# EAGLE board Preselector - Copy (EAGLE 7.7.0)
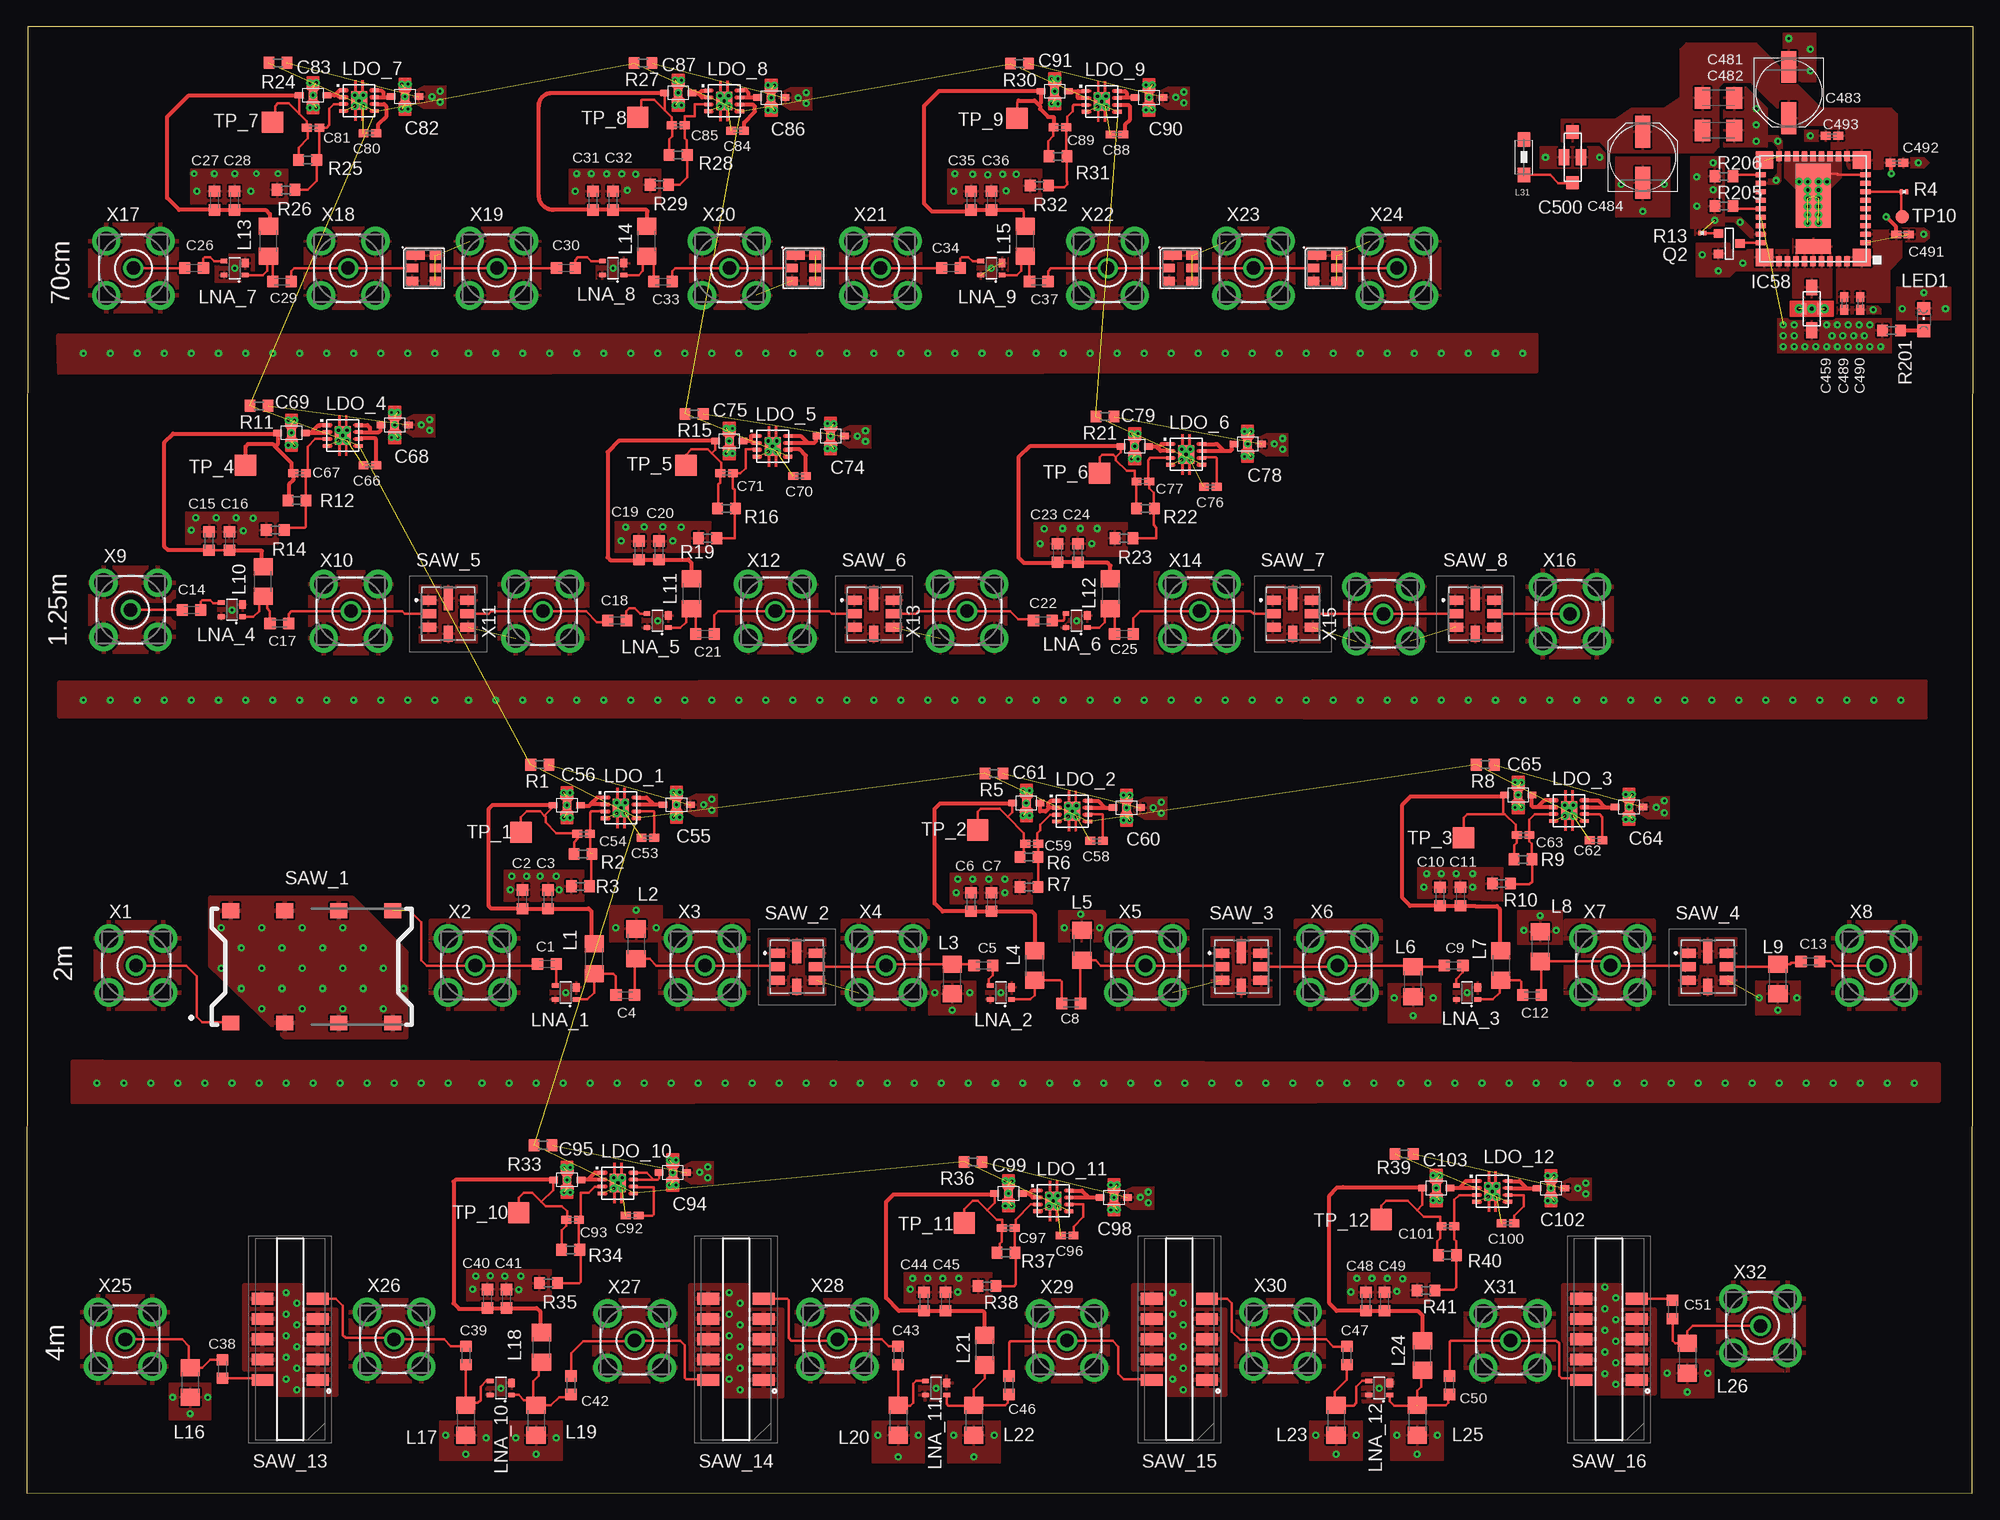
[diagram p5: board, top side]
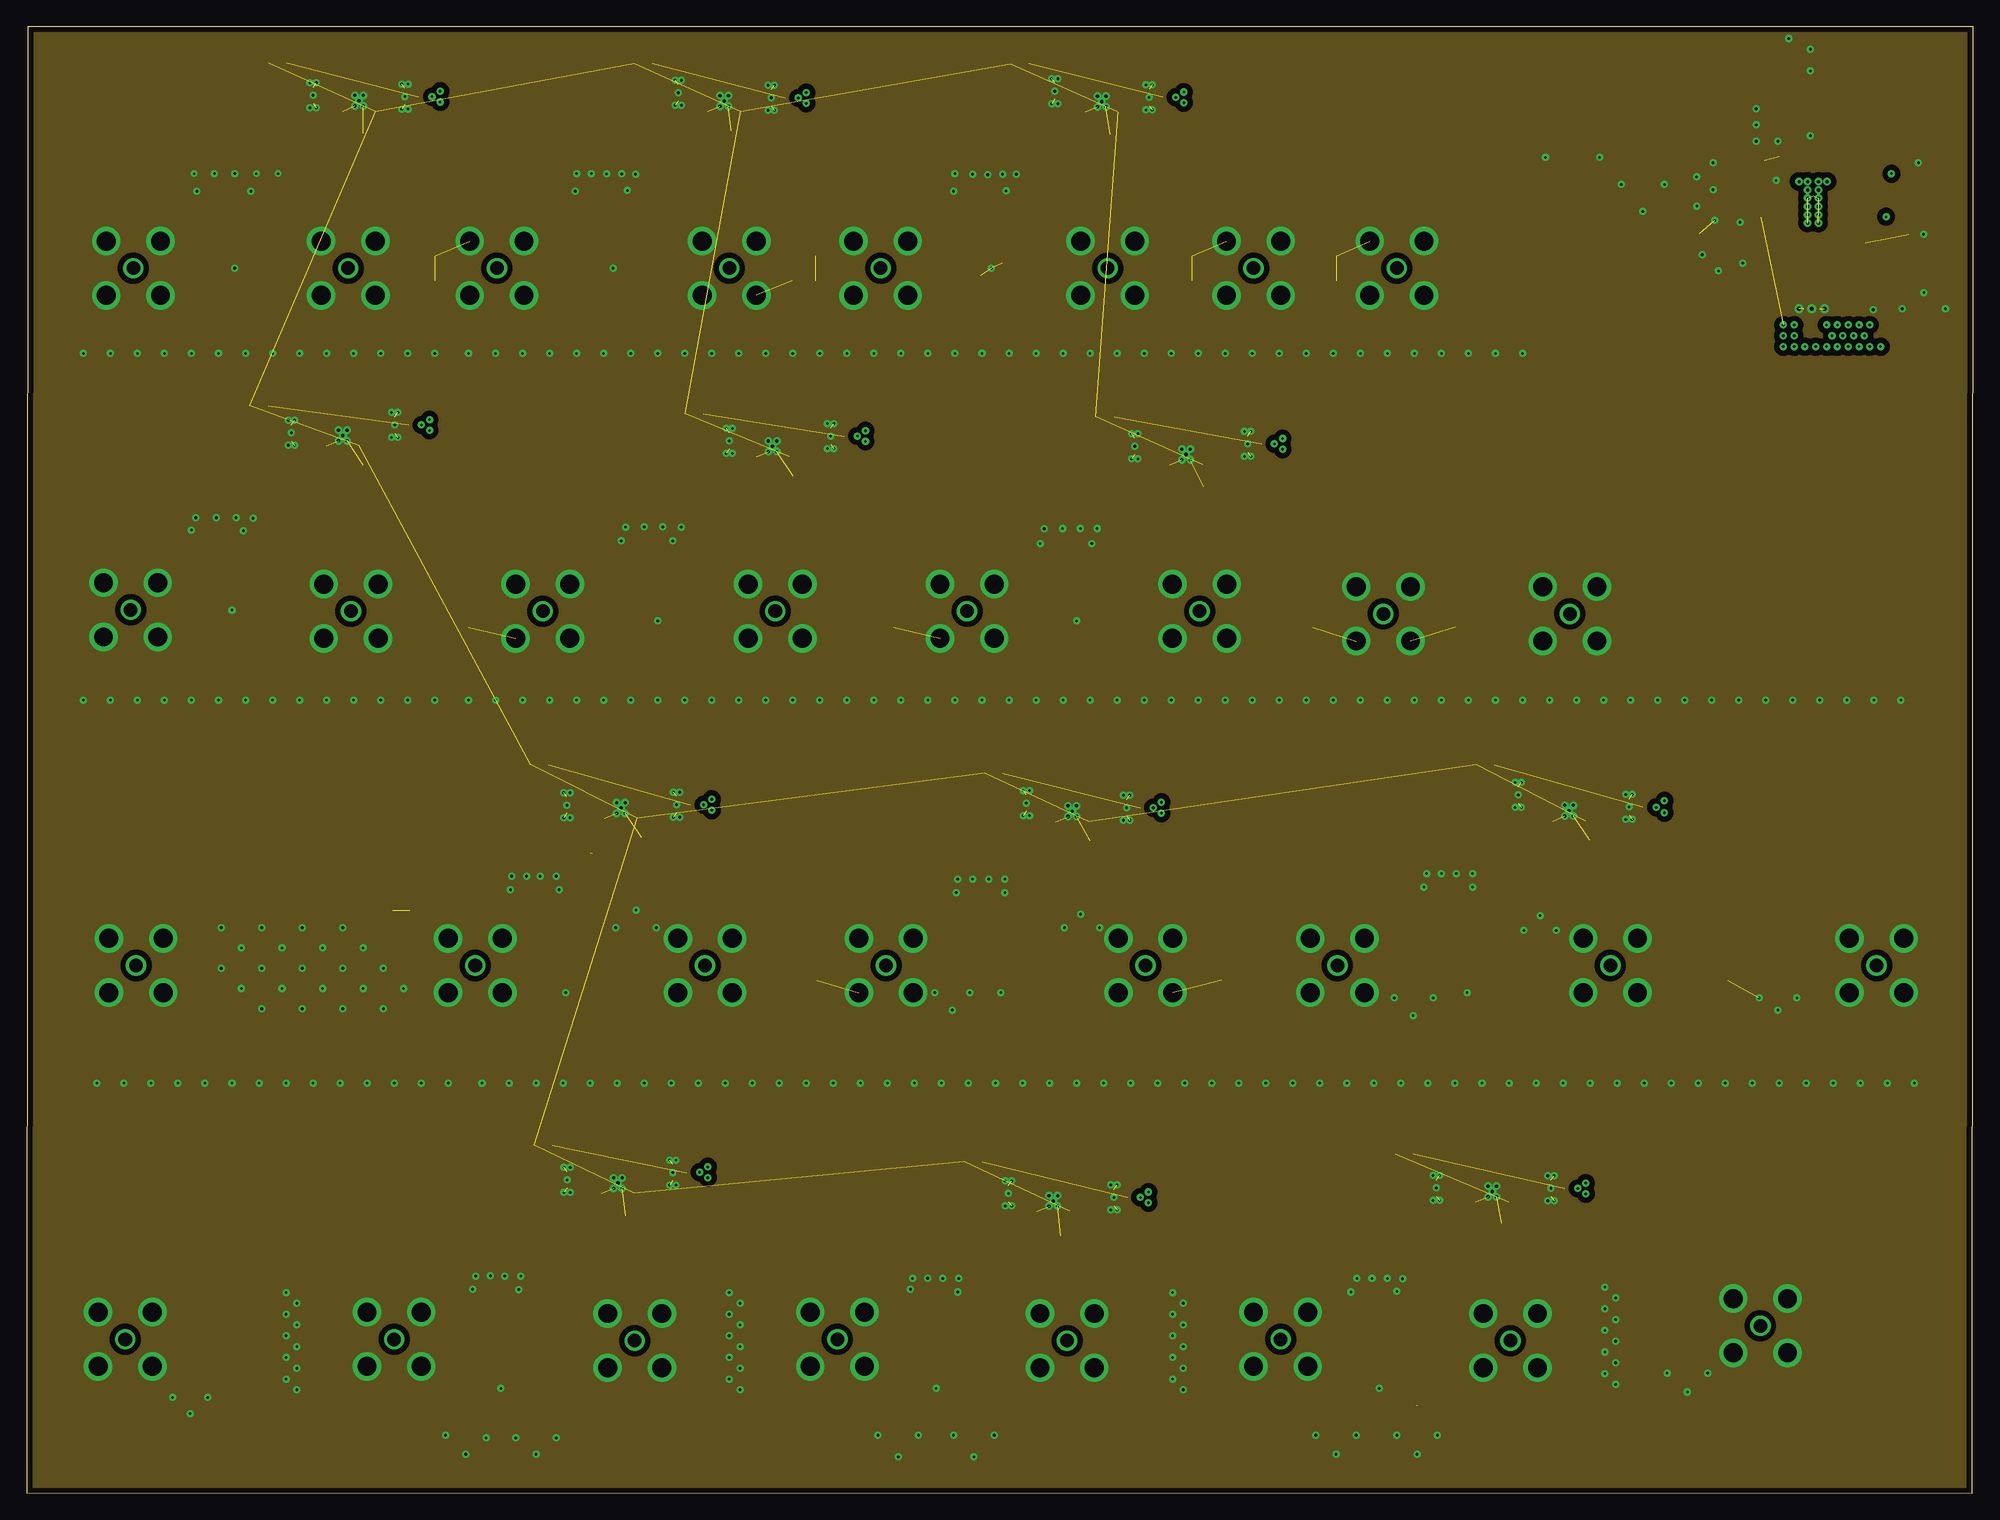
[diagram p6: board, inner layer GND]
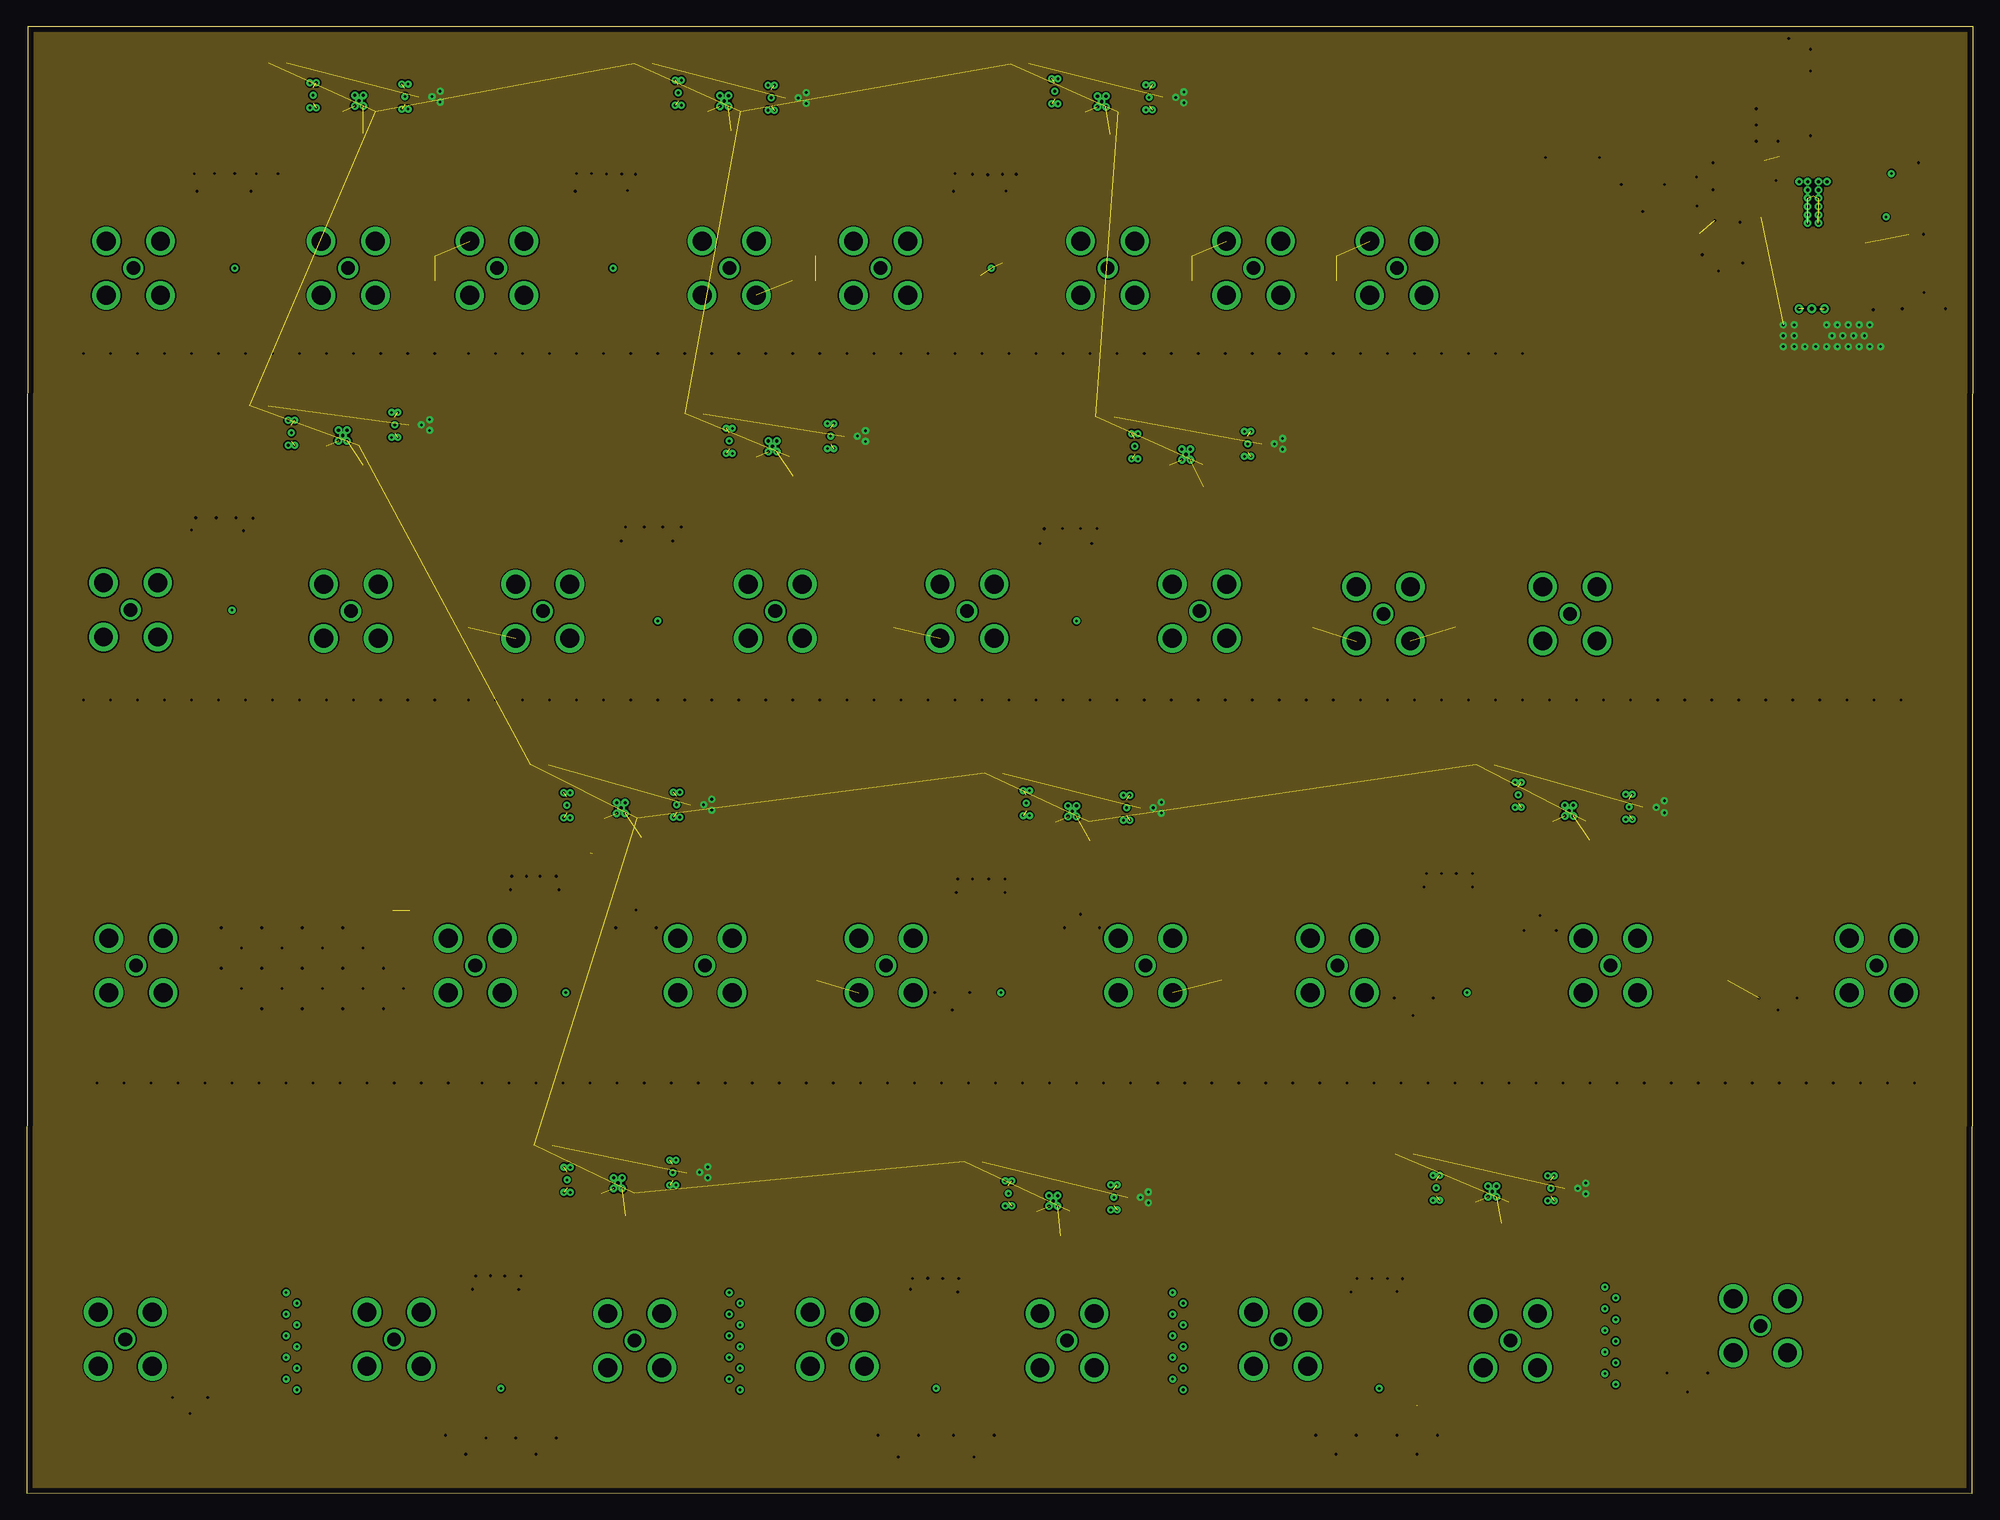
[diagram p7: board, inner layer PWR]
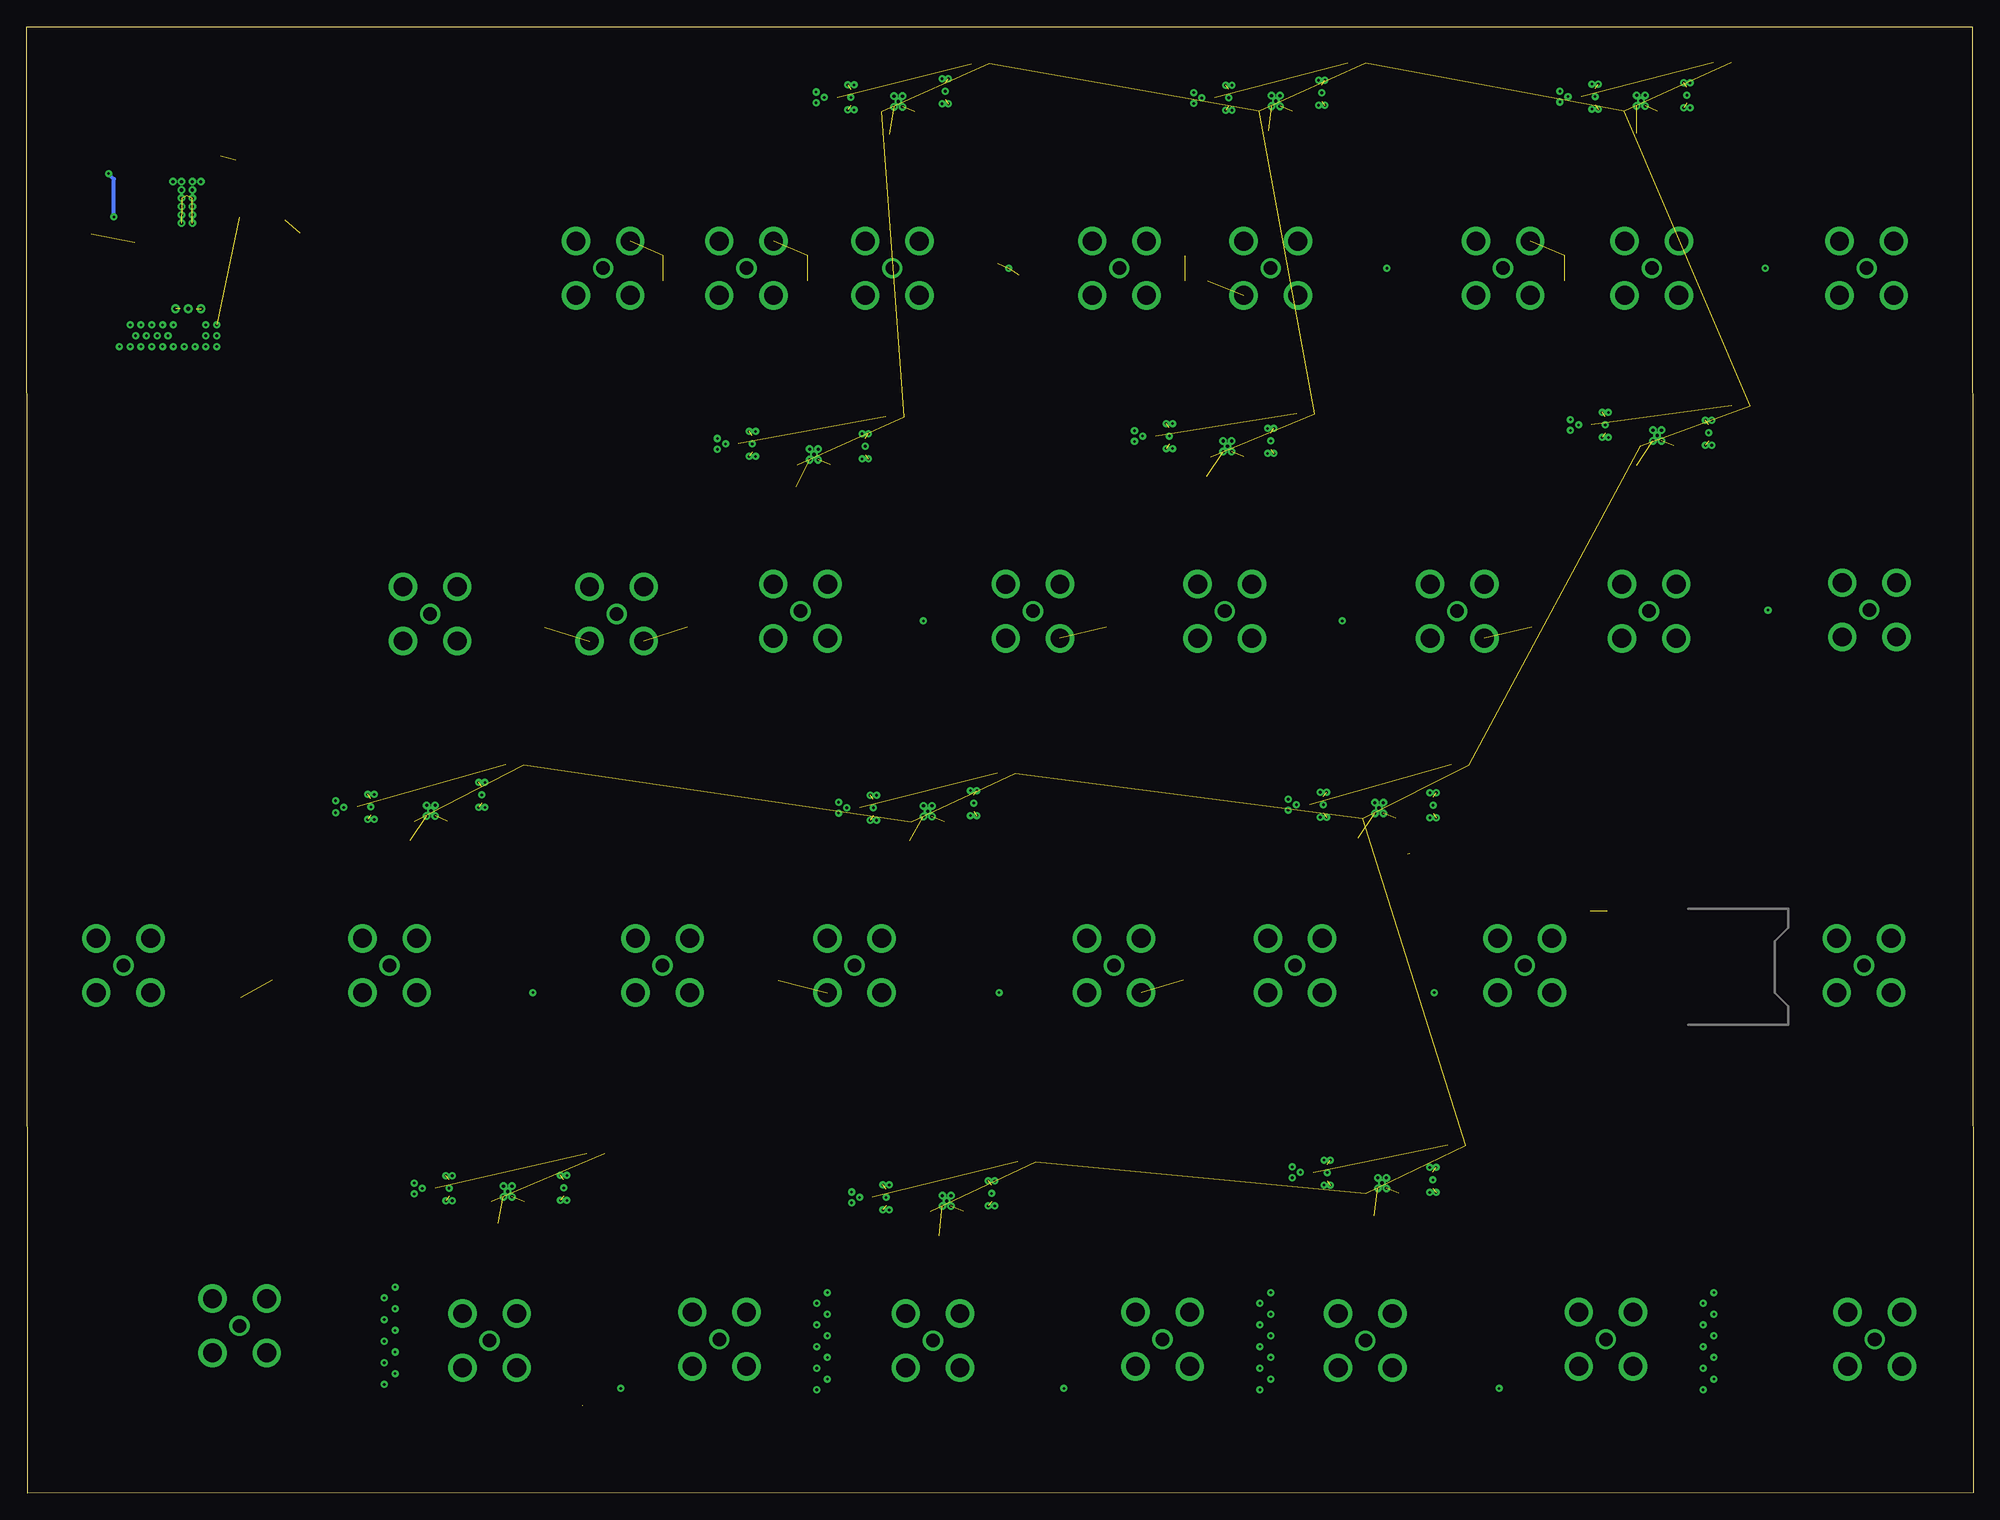
[diagram p8: board, bottom side, seen from below]

Size 182.96 x 137.82 mm. Coordinates in mm from the lower left corner, seen from the top.
Outline: 0,0.05 182.86,0 182.96,137.82 0.1,137.82 0,0.05
Copper layers ((1*2)+(15*16)): Top 0.035mm / dielectric 0.15mm / GND 0.035mm / dielectric 0.15mm / PWR 0.035mm / dielectric 0.2mm / Bottom 0.035mm
Design rules "default *": minimum track width 8mil, minimum drill 8mil, track to track 5mil, track to pad 5mil, pad to pad 5mil, via to via 5mil, smd to smd 5mil, copper to edge 20mil, drill to drill 8mil, minimum pad ring 8mil, minimum via ring 8mil, stop-mask expansion 4mil, vias tented up to drill 0mil, thermal gap 8mil
Net classes: 0 default: width 0.102 mm, drill 0.203 mm, clearance 0.102 mm; 1 GND: width 0.203 mm, drill 0.229 mm, clearance 0.203 mm to class 0, clearance 0.203 mm

## Footprints (pad centres in the part's own frame; a part is rotated, then mirrored left to right if it is on the bottom)
C0603K = smd 1.05 x 1.08: 1 -0.875,0; 2 0.875,0
C0402K = smd 0.925 x 0.74: 1 -0.6,0; 2 0.6,0
NFM21PS = smd 0.8 x 0.85: GND1 0,0 | smd 1.2 x 0.3: GND2 0,-0.775; GND3 0,0.775 | drill 0.25: GND4 0,0; GND5 -0.3,-1.175; GND6 0.3,-1.175; GND7 0.3,1.175; GND8 -0.3,1.175 | smd 0.8 x 0.6: IN -1.3,0; OUT 1.3,0
NFM31PC276 = smd 1 x 0.5: GND1 0,0.75; GND2 0,-0.75 | drill 0.4: GND3 0,0; GND4 0,1.2; GND5 0,-1.2 | smd 1.5 x 1: IN -2,0; OUT 2,0
C1206K = smd 1.5 x 2: 1 -1.5,0; 2 1.5,0
PANASONIC_D = smd 3 x 1.4: + 2.4,0; - -2.4,0
NFM1806 = smd 1.25 x 1.2: 1 -2.375,0; 2 2.375,0 | smd 1.5 x 1: GND@1 0,-0.8; GND@2 0,0.8
RVQ = smd 1.65 x 1.65: 1 -4.575,-4.575; 11 4.575,-4.575; 21 4.575,4.575; 31 -4.575,4.575 | smd 0.5 x 0.95: 2 -3.2,-4.925; 3 -2.4,-4.925; 4 -1.6,-4.925; 5 -0.8,-4.925; 6 0,-4.925; 7 0.8,-4.925; 8 1.6,-4.925; 9 2.4,-4.925; 10 3.2,-4.925; 22 3.2,4.925; 23 2.4,4.925; 24 1.6,4.925; 25 0.8,4.925; 26 0,4.925; 27 -0.8,4.925; 28 -1.6,4.925; 29 -2.4,4.925; 30 -3.2,4.925 | smd 0.95 x 0.5: 12 4.925,-3.2; 13 4.925,-2.4; 14 4.925,-1.6; 15 4.925,-0.8; 16 4.925,0; 17 4.925,0.8; 18 4.925,1.6; 19 4.925,2.4; 20 4.925,3.2; 32 -4.925,3.2; 33 -4.925,2.4; 34 -4.925,1.6; 35 -4.925,0.8; 36 -4.925,0; 37 -4.925,-0.8; 38 -4.925,-1.6; 39 -4.925,-2.4; 40 -4.925,-3.2 | smd 1.4 x 3.29: 41 -3.55,0 | smd 6.05 x 3.29: 42 1.225,0 | drill 0.3 pad 0.61: 42A -1.35,-0.51; 42B -1.35,0.51; 42C -0.57,-0.51; 42D -0.57,0.51; 42E 0.21,-0.51; 42F 0.21,0.51; 42G 0.99,-0.51; 42H 0.99,0.51; 42J 1.77,-0.51; 42K 1.77,0.51; 42L 2.55,-0.51; 42M 2.55,0.51; 42N 2.55,-1.31; 42P 2.55,1.31
C1206 = smd 1.6 x 1.8: 1 -1.4,0; 2 1.4,0
1206 = smd 1.35 x 1.2: 1 -1.7,0; 2 1.65,0
DRB = smd 0.35 x 0.65: 1 -0.975,-1.55; 2 -0.325,-1.55; 3 0.325,-1.55; 4 0.975,-1.55; 5 0.975,1.55; 6 0.325,1.55; 7 -0.325,1.55; 8 -0.975,1.55 | drill 0.3 pad 0.406: P1 -0.5,0.4; P2 0.5,0.4; P3 0,0; P4 -0.5,-0.4; P5 0.5,-0.4 | smd 1.75 x 1.5: PAD 0,0
CHIPLED_0805 = smd 1.2 x 1.2: A 0,-1.05; C 0,1.05
SPF-5043Z = smd 0.425 x 0.64: 1 -0.65,-0.995; 3 0.67,1; 4 -0.65,1 | smd 0.8 x 0.64: 2 0.48,-0.995
SOT-23 = smd 0.787 x 0.889: 1 0.025,-1.016; 2 -0.94,1.016; 3 0.991,1.016
R0603 = smd 1 x 1.1: 1 -0.85,0; 2 0.85,0
R0201 = smd 0.28 x 0.43: 1 -0.255,0; 2 0.255,0
SXBP-140+ = smd 1.626 x 1.397: 1 -7.62,-5.397; 2 -7.62,5.144; 3 -2.54,-5.397; 4 -2.54,5.144; 5 2.54,-5.397; 6 2.54,5.144; 7 7.62,-5.397; 8 7.62,5.144
TA147FD = smd 1.47 x 0.84: 1 -1.865,1.27; 2 -1.865,0; 3 -1.865,-1.27; 5 1.865,-1.27; 6 1.865,0; 7 1.865,1.27 | smd 0.84 x 1.47: 4 0,-1.865 | smd 0.84 x 2.28: 8 0,1.46
TA0576A = smd 1.47 x 0.84: 1 -1.865,1.27; 2 -1.865,0; 3 -1.865,-1.27; 5 1.865,-1.27; 6 1.865,0; 7 1.865,1.27 | smd 0.84 x 1.47: 4 0,-1.865 | smd 0.84 x 2.28: 8 0,1.46
TA1914A = smd 1.7 x 0.81: 1 -0.75,1.195 | smd 1.05 x 0.81: 2 -1.075,0.005; 3 -1.075,-1.185; 4 1.075,-1.185; 5 1.075,0.005; 6 1.075,1.195
S511214 = smd 2.05 x 1.1: 1 -2.6,3.82; 2 -2.6,1.91; 3 -2.6,0; 4 -2.6,-1.91; 5 -2.6,-3.82; 6 2.6,-3.82; 7 2.6,-1.91; 8 2.6,0; 9 2.6,1.91; 10 2.6,3.82
B1,27 = smd 1.27 x 1.27: TP 0,0
TP20SQ = smd 2 x 2: TP 0,0
BU-SMA-V = drill 1.27: 1 0,0 | drill 1.778: 2 -2.55,2.55; 3 2.55,2.55; 4 2.55,-2.55; 5 -2.55,-2.55

## Placement (x,y rotation side)
C1  100p  [C0603K]  48.9,49.71 0 top
C2  0.1u  [C0603K]  46.61,55.8 90 top
C3  100p  [C0603K]  49.02,55.8 90 top
C4  8p  [C0603K]  56.26,46.79 0 top
C5  12p  [C0603K]  89.92,49.58 0 top
C6  0.1u  [C0603K]  88.77,55.55 90 top
C7  100p  [C0603K]  90.68,55.55 90 top
C8  8p  [C0603K]  98.17,46.02 180 top
C9  12p  [C0603K]  134.11,49.58 0 top
C10  0.1u  [C0603K]  132.84,56.06 90 top
C11  100p  [C0603K]  134.75,56.06 90 top
C12  8p  [C0603K]  141.48,46.79 0 top
C13  12p  [C0603K]  167.64,49.96 0 top
C14  100p  [C0603K]  15.49,83.01 0 top
C15  0.1u  [C0603K]  17.14,89.48 90 top
C16  100p  [C0603K]  19.05,89.48 90 top
C17  100p  [C0603K]  23.75,81.74 0 top
C18  100p  [C0603K]  55.5,81.99 0 top
C19  0.1u  [C0603K]  57.53,88.6 90 top
C20  100p  [C0603K]  59.44,88.6 90 top
C21  100p  [C0603K]  63.75,80.72 0 top
C22  100p  [C0603K]  95.5,81.99 0 top
C23  0.1u  [C0603K]  96.9,88.34 90 top
C24  100p  [C0603K]  98.81,88.34 90 top
C25  100p  [C0603K]  103.12,80.72 0 top
C26  100p  [C0603K]  15.75,115.11 0 top
C27  0.1u  [C0603K]  17.65,121.46 90 top
C28  100p  [C0603K]  19.56,121.46 90 top
C29  100p  [C0603K]  24,113.84 0 top
C30  100p  [C0603K]  50.67,115.11 0 top
C31  0.1u  [C0603K]  53.21,121.46 90 top
C32  100p  [C0603K]  55.12,121.46 90 top
C33  100p  [C0603K]  59.82,113.84 0 top
C34  100p  [C0603K]  86.87,115.11 0 top
C35  0.1u  [C0603K]  88.77,121.46 90 top
C36  100p  [C0603K]  90.68,121.46 90 top
C37  100p  [C0603K]  95.12,113.84 0 top
C38  160p  [C0603K]  18.41,11.66 270 top
C39  180p  [C0603K]  41.27,12.93 270 top
C40  0.1u  [C0603K]  43.31,18.26 90 top
C41  100p  [C0603K]  45.09,18.26 90 top
C42  160p  [C0603K]  51.18,10.13 90 top
C43  180p  [C0603K]  81.92,12.93 270 top
C44  0.1u  [C0603K]  84.33,18.01 90 top
C45  100p  [C0603K]  86.36,18.01 90 top
C46  160p  [C0603K]  92.33,10.13 90 top
C47  180p  [C0603K]  124.08,12.93 270 top
C48  0.1u  [C0603K]  125.86,18.01 90 top
C49  100p  [C0603K]  127.64,18.01 90 top
C50  160p  [C0603K]  133.73,10.13 90 top
C51  180p  [C0603K]  154.69,17.25 270 top
C53  470n  [C0402K]  58.39,61.59 180 top
C54  470n  [C0402K]  52.35,61.95 180 top
C55  NFM21PS106B0J3D  [NFM21PS]  61.09,64.69 180 top
C56  NFM21PS106B0J3D  [NFM21PS]  50.77,64.64 180 top
C58  470n  [C0402K]  100.56,61.29 180 top
C59  470n  [C0402K]  94.46,61.04 180 top
C60  NFM21PS106B0J3D  [NFM21PS]  103.38,64.41 180 top
C61  NFM21PS106B0J3D  [NFM21PS]  93.95,64.85 180 top
C62  470n  [C0402K]  147.5,61.34 180 top
C63  470n  [C0402K]  140.64,61.85 180 top
C64  NFM21PS106B0J3D  [NFM21PS]  150.6,64.49 180 top
C65  NFM21PS106B0J3D  [NFM21PS]  140.18,65.61 180 top
C66  470n  [C0402K]  32.26,96.6 180 top
C67  470n  [C0402K]  25.65,95.83 180 top
C68  NFM21PS106B0J3D  [NFM21PS]  34.59,100.38 180 top
C69  NFM21PS106B0J3D  [NFM21PS]  24.89,99.64 180 top
C70  470n  [C0402K]  72.64,95.58 180 top
C71  470n  [C0402K]  65.79,95.83 180 top
C74  NFM21PS106B0J3D  [NFM21PS]  75.56,99.34 180 top
C75  NFM21PS106B0J3D  [NFM21PS]  66.04,98.88 180 top
C76  470n  [C0402K]  111.25,94.56 180 top
C77  470n  [C0402K]  104.9,95.07 180 top
C78  NFM21PS106B0J3D  [NFM21PS]  114.76,98.6 180 top
C79  NFM21PS106B0J3D  [NFM21PS]  104.14,98.37 180 top
C80  470n  [C0402K]  32.26,127.81 180 top
C81  470n  [C0402K]  26.92,128.32 180 top
C82  NFM21PS106B0J3D  [NFM21PS]  35.56,131.24 180 top
C83  NFM21PS106B0J3D  [NFM21PS]  26.92,131.37 180 top
C84  470n  [C0402K]  66.83,128.04 180 top
C85  470n  [C0402K]  61.24,128.55 180 top
C86  NFM21PS106B0J3D  [NFM21PS]  69.98,131.14 180 top
C87  NFM21PS106B0J3D  [NFM21PS]  61.24,131.6 180 top
C88  470n  [C0402K]  102.46,127.69 180 top
C89  470n  [C0402K]  97.1,128.35 180 top
C90  NFM21PS106B0J3D  [NFM21PS]  105.49,131.17 180 top
C91  NFM21PS106B0J3D  [NFM21PS]  96.62,131.75 180 top
C92  470n  [C0402K]  56.92,26.09 180 top
C93  470n  [C0402K]  51.31,25.7 180 top
C94  NFM21PS106B0J3D  [NFM21PS]  60.73,30.12 180 top
C95  NFM21PS106B0J3D  [NFM21PS]  50.8,29.44 180 top
C96  470n  [C0402K]  97.79,24.21 180 top
C97  470n  [C0402K]  92.25,24.92 180 top
C98  NFM21PS106B0J3D  [NFM21PS]  102.18,27.79 180 top
C99  NFM21PS106B0J3D  [NFM21PS]  92.28,28.17 180 top
C100  470n  [C0402K]  139.22,25.35 180 top
C101  470n  [C0402K]  133.58,25.07 180 top
C102  NFM21PS106B0J3D  [NFM21PS]  143.26,28.65 180 top
C103  NFM21PS106B0J3D  [NFM21PS]  132.49,28.68 180 top
C459  [NFM31PC276]  167.77,111.3 270 top
C481  33u  [C1206K]  159,131.11 0 top
C482  33u  [C1206K]  159,128.07 0 top
C483  EEE-FK1V470P  [PANASONIC_D]  165.61,131.62 270 top
C484  EEE-FK1V470P  [PANASONIC_D]  151.89,125.53 90 top
C489  .1u 50V  [C0402K]  170.81,111.81 270 top
C490  .1u 50V  [C0402K]  172.34,111.81 270 top
C491  .1u 50V  [C0402K]  176.3,118.29 0 top
C492  .1u 50V  [C0402K]  175.77,125.02 0 top
C493  .1u 50V  [C0402K]  169.67,127.56 180 top
C500  NFM41PC155B1E3  [NFM1806]  145.29,125.53 90 top
IC58  LMZ31707RVQ  [RVQ]  167.89,120.7 90 top
L1  100n  [C1206]  53.34,50.22 90 top
L2  56n  [C1206]  57.28,51.61 270 top
L3  47n  [C1206]  87,48.31 90 top
L4  100n  [C1206]  94.74,49.58 90 top
L5  56n  [C1206]  99.19,51.49 270 top
L6  47n  [C1206]  130.3,48.06 90 top
L7  100n  [C1206]  138.56,49.58 270 top
L8  56n  [C1206]  142.24,51.36 270 top
L9  47n  [C1206]  164.59,48.31 90 top
L10  100n  [C1206]  22.23,85.67 90 top
L11  100n  [C1206]  62.48,84.53 90 top
L12  100n  [C1206]  101.85,84.53 270 top
L13  100n  [C1206]  22.73,117.65 90 top
L14  100n  [C1206]  58.29,117.65 90 top
L15  100n  [C1206]  93.85,117.65 90 top
L16  100n  [C1206]  15.37,10.39 270 top
L17  100n  [C1206]  41.27,6.83 270 top
L18  100n  [C1206]  48.39,13.69 90 top
L19  100n  [C1206]  47.88,6.83 270 top
L20  100n  [C1206]  81.92,6.83 270 top
L21  100n  [C1206]  90.04,13.44 90 top
L22  100n  [C1206]  89.03,6.83 270 top
L23  100n  [C1206]  123.06,6.83 270 top
L24  100n  [C1206]  131.19,12.93 90 top
L25  100n  [C1206]  130.68,6.83 270 top
L26  100n  [C1206]  156.08,12.67 270 top
L31  BLM31PG121SN1L  [1206]  140.72,125.53 270 top
LDO_1  TPS7A8101DRB  [DRB]  55.85,64.39 270 top
LDO_2  TPS7A8101DRB  [DRB]  98.27,64.08 270 top
LDO_3  TPS7A8101DRB  [DRB]  144.96,64.13 270 top
LDO_4  TPS7A8101DRB  [DRB]  29.72,99.39 270 top
LDO_5  TPS7A8101DRB  [DRB]  70.1,98.37 270 top
LDO_6  TPS7A8101DRB  [DRB]  108.97,97.61 270 top
LDO_7  TPS7A8101DRB  [DRB]  31.24,130.86 270 top
LDO_8  TPS7A8101DRB  [DRB]  65.56,130.84 270 top
LDO_9  TPS7A8101DRB  [DRB]  101.04,130.78 270 top
LDO_10  TPS7A8101DRB  [DRB]  55.58,29.13 270 top
LDO_11  TPS7A8101DRB  [DRB]  96.49,27.46 270 top
LDO_12  TPS7A8101DRB  [DRB]  137.74,28.35 270 top
LED1  LTST-C170GKT  [CHIPLED_0805]  178.31,110.29 0 top
LNA_1  SPF-5043Z  [SPF-5043Z]  50.67,47.04 90 top
LNA_2  SPF-5043Z  [SPF-5043Z]  91.57,47.04 90 top
LNA_3  SPF-5043Z  [SPF-5043Z]  135.38,47.04 90 top
LNA_4  SPF-5043Z  [SPF-5043Z]  19.3,83.01 90 top
LNA_5  SPF-5043Z  [SPF-5043Z]  59.31,81.99 90 top
LNA_6  SPF-5043Z  [SPF-5043Z]  98.68,81.99 90 top
LNA_7  SPF-5043Z  [SPF-5043Z]  19.56,115.11 90 top
LNA_8  SPF-5043Z  [SPF-5043Z]  55.12,115.11 90 top
LNA_9  SPF-5043Z  [SPF-5043Z]  90.68,115.11 90 top
LNA_10  SPF-5043Z  [SPF-5043Z]  44.58,9.88 90 top
LNA_11  SPF-5043Z  [SPF-5043Z]  85.47,9.88 90 top
LNA_12  SPF-5043Z  [SPF-5043Z]  127.13,9.88 90 top
Q2  FDV303N  [SOT-23]  160.02,117.4 90 top
R1  10.0k  [R0603]  48.23,68.45 180 top
R2  52.3k  [R0603]  52.3,60.07 0 top
R3  10.0k  [R0603]  52.04,57.02 180 top
R4  100k  [R0201]  176.45,122.3 0 top
R5  10.0k  [R0603]  90.91,67.64 180 top
R6  52.3k  [R0603]  94.21,59.77 0 top
R7  10.0k  [R0603]  94.21,56.97 180 top
R8  10.0k  [R0603]  137.08,68.45 180 top
R9  52.3k  [R0603]  140.64,59.56 0 top
R10  10.0k  [R0603]  138.61,57.28 180 top
R11  10.0k  [R0603]  21.84,102.18 180 top
R12  52.3k  [R0603]  25.4,93.29 0 top
R13  100k  [R0201]  157.48,118.41 180 top
R14  10.0k  [R0603]  23.37,90.5 180 top
R15  10.0k  [R0603]  62.74,101.42 180 top
R16  52.3k  [R0603]  65.79,92.53 0 top
R19  10.0k  [R0603]  64.01,89.74 180 top
R21  10.0k  [R0603]  101.35,101.17 180 top
R22  52.3k  [R0603]  105.16,92.53 0 top
R23  10.0k  [R0603]  103.12,89.74 180 top
R24  10.0k  [R0603]  23.62,134.42 180 top
R25  52.3k  [R0603]  26.42,125.27 0 top
R26  10.0k  [R0603]  24.38,122.48 180 top
R27  10.0k  [R0603]  57.94,134.39 180 top
R28  52.3k  [R0603]  61.24,125.76 0 top
R29  10.0k  [R0603]  59.46,122.96 180 top
R30  10.0k  [R0603]  93.32,134.34 180 top
R31  52.3k  [R0603]  96.93,125.63 0 top
R32  10.0k  [R0603]  95.17,122.89 180 top
R33  10.0k  [R0603]  48.54,32.69 180 top
R34  52.3k  [R0603]  51.13,22.86 0 top
R35  10.0k  [R0603]  49.05,19.74 180 top
R36  10.0k  [R0603]  88.95,31.11 180 top
R37  52.3k  [R0603]  92.05,22.58 0 top
R38  10.0k  [R0603]  90.27,19.46 180 top
R39  10.0k  [R0603]  129.46,31.88 180 top
R40  52.3k  [R0603]  133.53,22.35 0 top
R41  10.0k  [R0603]  131.52,19.05 180 top
R201  560  [R0603]  175.26,109.27 180 top
R205  182  [R0603]  159.51,120.95 0 top
R206  53.6k  [R0603]  159.51,123.75 0 top
SAW_1  SXBP-140+  [SXBP-140+]  26.8,49.58 0 top
SAW_2  TA147FD  [TA147FD]  72.39,49.45 0 top
SAW_3  TA147FD  [TA147FD]  114.17,49.45 0 top
SAW_4  TA147FD  [TA147FD]  157.99,49.45 0 top
SAW_5  TA0576A  [TA0576A]  39.62,82.63 0 top
SAW_6  TA0576A  [TA0576A]  79.63,82.63 0 top
SAW_7  TA0576A  [TA0576A]  119,82.63 0 top
SAW_8  TA0576A  [TA0576A]  136.14,82.63 0 top
SAW_9  TA1914A  [TA1914A]  37.34,115.11 0 top
SAW_10  TA1914A  [TA1914A]  73.03,115.11 0 top
SAW_11  TA1914A  [TA1914A]  108.46,115.11 0 top
SAW_12  TA1914A  [TA1914A]  122.05,115.11 0 top
SAW_13  S511214  [S511214]  24.77,14.45 180 top
SAW_14  S511214  [S511214]  66.67,14.45 180 top
SAW_15  S511214  [S511214]  108.33,14.45 180 top
SAW_16  S511214  [S511214]  148.72,14.45 180 top
TP10  TPSQB1,27  [B1,27]  176.28,119.94 0 top
TP_1  TPTP20SQ  [TP20SQ]  46.46,62.1 270 top
TP_2  TPTP20SQ  [TP20SQ]  89.38,62.31 270 top
TP_3  TPTP20SQ  [TP20SQ]  135.05,61.59 270 top
TP_4  TPTP20SQ  [TP20SQ]  20.57,96.6 270 top
TP_5  TPTP20SQ  [TP20SQ]  61.98,96.6 270 top
TP_6  TPTP20SQ  [TP20SQ]  100.84,95.83 270 top
TP_7  TPTP20SQ  [TP20SQ]  23.11,128.83 270 top
TP_8  TPTP20SQ  [TP20SQ]  57.43,129.31 270 top
TP_9  TPTP20SQ  [TP20SQ]  93.09,129.21 270 top
TP_10  TPTP20SQ  [TP20SQ]  46.25,26.34 270 top
TP_11  TPTP20SQ  [TP20SQ]  88.11,25.37 270 top
TP_12  TPTP20SQ  [TP20SQ]  127.3,25.7 270 top
X1  0733660061  [BU-SMA-V]  10.29,49.58 0 top
X2  0733660061  [BU-SMA-V]  42.16,49.58 0 top
X3  0733660061  [BU-SMA-V]  63.75,49.58 0 top
X4  0733660061  [BU-SMA-V]  80.77,49.58 0 top
X5  0733660061  [BU-SMA-V]  105.16,49.58 0 top
X6  0733660061  [BU-SMA-V]  123.19,49.58 0 top
X7  0733660061  [BU-SMA-V]  148.84,49.58 0 top
X8  0733660061  [BU-SMA-V]  173.86,49.58 0 top
X9  0733660061  [BU-SMA-V]  9.78,83.01 0 top
X10  0733660061  [BU-SMA-V]  30.48,82.88 90 top
X11  0733660061  [BU-SMA-V]  48.51,82.88 90 top
X12  0733660061  [BU-SMA-V]  70.36,82.88 90 top
X13  0733660061  [BU-SMA-V]  88.39,82.88 90 top
X14  0733660061  [BU-SMA-V]  110.24,82.88 90 top
X15  0733660061  [BU-SMA-V]  127.51,82.63 90 top
X16  0733660061  [BU-SMA-V]  145.03,82.63 0 top
X17  0733660061  [BU-SMA-V]  10.03,115.11 0 top
X18  0733660061  [BU-SMA-V]  30.23,115.11 0 top
X19  0733660061  [BU-SMA-V]  44.2,115.11 0 top
X20  0733660061  [BU-SMA-V]  66.04,115.11 0 top
X21  0733660061  [BU-SMA-V]  80.26,115.11 0 top
X22  0733660061  [BU-SMA-V]  101.6,115.11 0 top
X23  0733660061  [BU-SMA-V]  115.32,115.11 0 top
X24  0733660061  [BU-SMA-V]  128.78,115.11 0 top
X25  0733660061  [BU-SMA-V]  9.27,14.45 0 top
X26  0733660061  [BU-SMA-V]  34.54,14.45 0 top
X27  0733660061  [BU-SMA-V]  57.15,14.33 0 top
X28  0733660061  [BU-SMA-V]  76.2,14.45 0 top
X29  0733660061  [BU-SMA-V]  97.79,14.33 0 top
X30  0733660061  [BU-SMA-V]  117.86,14.45 0 top
X31  0733660061  [BU-SMA-V]  139.45,14.33 0 top
X32  0733660061  [BU-SMA-V]  162.94,15.72 0 top

## Tracks (layer width: path | path; a pad name or v marks a point on that pad's centre or on a via)
1.25_RF_OUT
  Top 0.254: SAW_8.6 X16.1
1.25M_RF_IN
  Top 0.254: X9.1 C14.1
2M_RF_IN
  Top 0.254: X1.1 14.99,49.58 16,48.56 16,44.75 16.51,44.25 19.11,44.25 SAW_1.1
2M_RF_OUT
  Top 0.254: C13.2 169.54,49.96 169.93,49.58 X8.1
4M_RF_IN
  Top 0.254: X25.1 14.61,14.45 15.24,13.82 15.24,11.92 L16.1 16.51,11.79 17.27,12.55 18.4,12.55 C38.1
4M_RF_OUT
  Top 0.254: C51.2 154.69,14.33 154.94,14.07 L26.1 156.08,15.21 156.59,15.72 X32.1
70CM_RF_IN
  Top 0.254: X17.1 C26.1
70CM_RF_OUT
  Top 0.254: SAW_12.5 X24.1
+5V3  (via drill 0.25)  (13 unrouted)
  other vias: 64.01,30.66 64.01,29.64 63.25,30.15 64.39,65.2 64.39,64.19 63.63,64.69 105.44,28.3 105.44,27.28 104.67,27.79 146.53,29.13 146.53,28.12 145.77,28.63 106.65,64.92 106.65,63.91 105.89,64.41 37.87,100.89 37.87,99.87 37.11,100.38 78.84,99.85 78.84,98.83 78.08,99.34 118.03,99.11 118.03,98.09 117.27,98.6 108.76,131.67 108.76,130.66 108,131.17 165.1,109.78 166.12,109.78 165.1,108.76 166.12,108.76 165.1,107.75 166.12,107.75 167.13,107.75 168.15,107.75 169.16,107.75 170.18,107.75 171.2,107.75 172.21,107.75 173.23,107.75 174.24,107.75 172.72,108.76 173.23,109.78 172.21,109.78 171.2,109.78 170.18,109.78 169.16,109.78 169.67,108.76 170.69,108.76 171.7,108.76 73.28,131.62 73.28,130.61 72.52,131.11 38.86,131.75 38.86,130.73 38.1,131.24 153.16,64.44 153.92,65.07 153.92,63.93
  pour Top (isolate 0.254): 164.59,110.41 175.26,110.41 175.26,107.11 164.59,107.11
  pour PWR: 0,0.05 0,137.72 182.88,137.72 182.88,0.05
  pour Top: 61.47,30.66 62.48,31.17 64.52,31.17 64.52,29.01 62.48,29.01 61.47,29.64
  pour Top: 61.85,65.2 62.87,65.71 64.9,65.71 64.9,63.55 62.87,63.55 61.85,64.19
  pour Top: 102.9,28.3 103.91,28.8 105.94,28.8 105.94,26.64 103.91,26.64 102.9,27.28
  pour Top: 143.99,29.13 145.01,29.64 147.04,29.64 147.04,27.48 145.01,27.48 143.99,28.12
  pour Top: 104.11,64.92 105.13,65.43 107.16,65.43 107.16,63.27 105.13,63.27 104.11,63.91
  pour Top: 151.33,65 152.35,65.51 154.38,65.51 154.38,63.35 152.35,63.35 151.33,63.98
  pour Top: 35.33,100.89 36.35,101.4 38.38,101.4 38.38,99.24 36.35,99.24 35.33,99.87
  pour Top: 76.3,99.85 77.32,100.36 79.35,100.36 79.35,98.2 77.32,98.2 76.3,98.83
  pour Top: 115.49,99.11 116.51,99.62 118.54,99.62 118.54,97.46 116.51,97.46 115.49,98.09
  pour Top: 106.22,131.67 107.24,132.18 109.27,132.18 109.27,130.02 107.24,130.02 106.22,130.66
  pour Top: 70.74,131.62 71.75,132.13 73.79,132.13 73.79,129.97 71.75,129.97 70.74,130.61
  pour Top: 36.32,131.75 37.34,132.26 39.37,132.26 39.37,130.1 37.34,130.1 36.32,130.73
+5V3_INH
  Top 0.254: Q2.3 157.74,118.39 R13.1
+13.8V_SW_FIL  (via drill 0.25)
  Top 0.356: C491.1 175.7,118.99 v174.75,119.94 | v175.26,124 175.26,124.93 C492.1
  Bottom 0.356: v174.75,119.94 174.75,123.49 v175.26,124
  pour Top (isolate 0.127): 144.27,127.05 147.83,127.05 148.84,126.03 158.5,126.03 159,126.54 159,132.13 159.51,132.64 162.05,132.64 166.12,128.57 169.16,128.57 169.67,128.07 169.67,125.53 170.81,125.53 171.32,124.38 175.77,124.51 175.77,129.59 175.26,130.1 168.66,130.1 162.56,136.19 155.96,136.19 155.45,135.69 155.45,131.11 153.92,130.1 150.88,130.1 149.35,129.08 144.27,129.08
  pour Top: 170.05,116.26 170.05,111.81 175.13,111.94 175.13,114.99 176.28,116.13 176.28,118.67 172.34,118.67 172.34,117.91 173.35,117.91 173.48,117.78 173.48,117.14 173.35,117.02 172.59,117.02 172.59,116.26
GND  (via drill 0.2 layers 1-2, 0.25, 0.25 layers 1-2)  (94 unrouted)
  other vias: 6.6,38.53 9.14,38.53 11.68,38.53 14.22,38.53 16.76,38.53 19.3,38.53 18.29,53.14 22.1,53.14 25.91,53.14 29.72,53.14 31.62,51.23 27.81,51.23 24,51.23 20.19,51.23 18.29,49.33 22.1,49.33 25.91,49.33 29.72,49.33 33.53,49.33 35.43,47.42 31.62,47.42 27.81,47.42 24,47.42 20.19,47.42 22.1,45.52 25.91,45.52 29.72,45.52 33.53,45.52 21.84,38.53 24.38,38.53 26.92,38.53 29.46,38.53 32,38.53 34.54,38.53 37.08,38.53 39.62,38.53 42.8,38.53 45.34,38.53 47.88,38.53 50.42,38.53 52.96,38.53 55.5,38.53 58.04,38.53 60.58,38.53 63.12,38.53 65.66,38.53 68.2,38.53 70.74,38.53 73.28,38.53 75.82,38.53 78.36,38.53 80.9,38.53 83.44,38.53 85.98,38.53 88.52,38.53 91.06,38.53 93.6,38.53 96.14,38.53 98.68,38.53 101.22,38.53 103.76,38.53 106.3,38.53 108.84,38.53 111.38,38.53 113.92,38.53 116.46,38.53 119,38.53 121.54,38.53 124.08,38.53 126.62,38.53 129.16,38.53 131.7,38.53 134.24,38.53 136.78,38.53 139.32,38.53 141.86,38.53 144.4,38.53 146.94,38.53 149.48,38.53 152.02,38.53 154.56,38.53 157.1,38.53 159.64,38.53 162.18,38.53 164.72,38.53 167.26,38.53 169.8,38.53 172.34,38.53 174.88,38.53 177.42,38.53 162.81,46.53 164.59,45.39 166.37,46.53 143.76,52.88 142.24,54.28 140.72,52.88 128.52,46.53 132.21,46.53 130.3,44.88 97.54,53.14 99.06,54.41 100.84,53.14 85.34,47.04 88.65,47.04 87,45.39 17.02,8.99 13.72,8.99 15.37,7.47 47.88,3.66 45.97,5.18 49.78,5.18 41.27,3.66 43.18,5.18 39.37,5.44 83.82,5.44 80.01,5.44 81.92,3.4 90.93,5.44 87.12,5.44 89.03,3.4 124.97,5.44 121.16,5.44 123.06,3.66 132.59,5.44 128.78,5.44 130.68,3.66 157.99,11.28 154.18,11.28 156.08,9.5 41.91,19.15 43.59,20.42 42.21,20.4 44.93,20.4 83.06,19.15 83.26,20.17 84.68,20.19 86.11,20.17 125.02,20.17 126.44,20.17 45.47,56.69 45.59,57.96 46.99,57.96 48.26,57.96 87.38,56.44 87.5,57.71 88.9,57.71 90.42,57.71 131.32,56.95 134.37,58.22 132.97,58.22 131.57,58.22 124.46,18.9 127.89,20.17 15.49,90.5 15.9,91.67 17.83,91.67 19.68,91.67 55.88,89.48 56.29,90.78 58.04,90.8 59.79,90.8 95.25,89.23 95.63,90.63 97.36,90.65 99.03,90.65 16,122.35 17.65,124 21.08,122.35 19.56,124 51.56,122.35 51.69,124 53.09,124 54.51,123.98 87.12,122.35 87.25,124 88.9,123.95 90.32,123.9 23.62,124 21.59,124 15.75,124 55.93,123.98 57.23,123.95 56.46,122.43 91.72,123.95 92.05,122.38 93.01,123.95 21.29,91.62 20.37,90.45 61.52,90.78 60.73,89.48 100.61,90.65 100.1,89.23 46.46,20.4 46.25,19.13 87.6,20.17 87.5,18.9 129.31,20.14 128.78,18.95 135.89,58.22 135.89,56.95 91.95,57.71 91.95,56.44 49.78,57.96 50.04,56.69 5.33,107.11 7.87,107.11 10.41,107.11 12.95,107.11 15.49,107.11 18.03,107.11 20.57,107.11 23.11,107.11 25.65,107.11 28.19,107.11 30.73,107.11 33.27,107.11 35.81,107.11 38.35,107.11 41.53,107.11 44.07,107.11 46.61,107.11 49.15,107.11 51.69,107.11 54.23,107.11 56.77,107.11 59.31,107.11 61.85,107.11 64.39,107.11 66.93,107.11 69.47,107.11 72.01,107.11 74.55,107.11 77.09,107.11 79.63,107.11 82.17,107.11 84.71,107.11 87.25,107.11 89.79,107.11 92.33,107.11 94.87,107.11 97.41,107.11 99.95,107.11 102.49,107.11 105.03,107.11 107.57,107.11 110.11,107.11 112.65,107.11 115.19,107.11 117.73,107.11 120.27,107.11 122.81,107.11 125.35,107.11 127.89,107.11 130.43,107.11 132.97,107.11 135.51,107.11 138.05,107.11 140.59,107.11 178.31,112.83 180.34,111.3 176.28,111.3 157.48,116.38 159,114.86 158.5,125.02 156.95,123.7 158.5,122.48 156.97,120.95 158.65,119.61 167.64,127.56 165.61,136.7 167.64,133.65 167.64,135.69 142.75,125.53 147.83,125.53 151.89,120.45 153.92,122.99 149.86,122.99 162.56,130.1 162.56,128.57 162.56,127.05 164.59,127.05 164.41,123.37 161.29,115.6 178.28,118.31 177.8,125.02 173.56,111.2 161.04,119.43 5.33,74.52 7.87,74.52 10.41,74.52 12.95,74.52 15.49,74.52 18.03,74.52 20.57,74.52 23.11,74.52 25.65,74.52 28.19,74.52 30.73,74.52 33.27,74.52 35.81,74.52 38.35,74.52 41.53,74.52 44.07,74.52 46.61,74.52 49.15,74.52 51.69,74.52 54.23,74.52 56.77,74.52 59.31,74.52 61.85,74.52 64.39,74.52 66.93,74.52 69.47,74.52 72.01,74.52 74.55,74.52 77.09,74.52 79.63,74.52 82.17,74.52 84.71,74.52 87.25,74.52 89.79,74.52 92.33,74.52 94.87,74.52 97.41,74.52 99.95,74.52 102.49,74.52 105.03,74.52 107.57,74.52 110.11,74.52 112.65,74.52 115.19,74.52 117.73,74.52 120.27,74.52 122.81,74.52 125.35,74.52 127.89,74.52 130.43,74.52 132.97,74.52 135.51,74.52 138.05,74.52 140.59,74.52 143.13,74.52 145.67,74.52 148.21,74.52 150.75,74.52 153.29,74.52 155.83,74.52 158.37,74.52 160.91,74.52 163.45,74.52 165.99,74.52 168.53,74.52 171.07,74.52 173.61,74.52 176.15,74.52 57.28,54.79 59.18,53.14 55.37,53.14 127.13,9.83 107.7,18.85 108.71,17.83 107.7,16.81 108.71,15.8 107.7,14.78 108.71,13.77 107.7,12.75 108.71,11.73 107.7,10.72 108.71,9.7 85.47,9.83 44.58,9.83 148.34,19.35 149.35,18.34 148.34,17.32 149.35,16.31 148.34,15.29 149.35,14.27 148.34,13.26 149.35,12.24 148.34,11.23 149.35,10.21 66.04,18.85 67.06,17.83 66.04,16.81 67.06,15.8 66.04,14.78 67.06,13.77 66.04,12.75 67.06,11.73 66.04,10.72 67.06,9.7 24.38,18.85 25.4,17.83 24.38,16.81 25.4,15.8 24.38,14.78 25.4,13.77 24.38,12.75 25.4,11.73 24.38,10.72 25.4,9.7 50.67,47.04 91.57,47.04 135.38,47.04 98.68,81.97 59.31,81.97 19.3,82.98 19.56,115.11 55.12,115.11 90.68,115.11
  pour Top: 113.41,50.22 111.38,50.22 111.38,52.25 116.97,52.25 116.97,50.22 114.94,50.22 114.94,48.56 116.97,48.56 116.97,46.66 111.38,46.66 111.38,48.69 113.41,48.69
  pour Top: 24.26,42.85 17.27,49.58 17.27,55.93 30.61,55.93 35.69,50.85 35.69,42.85
  pour Top: 71.75,50.34 69.72,50.34 69.72,52.12 75.06,52.12 75.06,50.34 73.03,50.34 73.03,48.56 75.06,48.56 75.06,46.79 69.72,46.79 69.72,48.56 71.75,48.56
  pour Top: 157.35,50.34 155.32,50.34 155.32,52.12 160.66,52.12 160.66,50.34 158.62,50.34 158.62,48.56 160.66,48.56 160.66,46.79 155.32,46.79 155.32,48.56 157.35,48.56
  pour Top: 169.8,45.52 169.8,53.64 177.93,53.64 177.93,45.52
  pour Top: 6.48,53.64 14.35,53.64 14.35,45.52 6.48,45.52
  pour Top: 141.1,86.69 148.97,86.69 148.97,78.56 141.1,78.56
  pour Top (isolate 0.508): 5.97,86.94 13.84,86.94 13.84,79.07 5.97,79.07
  pour Top: 5.21,18.52 13.34,18.52 13.08,10.39 5.21,10.39
  pour Top: 5.97,119.18 14.1,119.18 14.1,111.05 5.97,111.05
  pour Top: 20.45,19.53 25.78,19.53 25.78,17.25 29.08,17.25 29.08,9.25 23.75,9.25 23.75,11.66 20.45,11.66
  pour Top: 62.36,19.53 67.69,19.53 67.69,17.25 70.99,17.25 70.99,9.12 65.66,9.12 65.66,11.66 62.36,11.66
  pour Top: 104.01,19.53 109.35,19.53 109.35,17.25 112.65,17.25 112.65,9.25 107.31,9.25 107.31,11.66 104.01,11.66
  pour Top: 83.95,10.13 85.09,10.13 85.09,11.02 87,11.02 87,9.75 85.85,9.75 85.85,8.74 83.95,8.74
  pour Top: 144.4,19.53 149.73,19.53 149.73,17.25 153.03,17.25 153.03,9.37 147.7,9.37 147.7,11.66 144.4,11.66
  pour Top: 125.6,11.15 128.4,11.15 128.4,9.88 127.38,9.88 127.38,8.61 125.6,8.61
  pour Top: 159,19.79 167,19.79 167,11.53 159,11.53
  pour GND (isolate 0.508, no thermals): 0,0.05 182.63,-1.22 182.88,137.82 -1.52,137.57 -0.25,0.3
  pour Top: 7.16,40.54 179.71,40.28 179.71,36.86 4.32,36.73 4.32,40.54
  pour Top: 30.48,18.14 38.1,18.14 38.1,10.52 30.48,10.52
  pour Top: 53.34,18.14 60.96,18.14 60.96,10.52 53.34,10.52
  pour Top: 72.39,18.14 80.01,18.14 80.01,10.52 72.39,10.52
  pour Top: 93.98,18.14 101.6,18.14 101.6,10.52 93.98,10.52
  pour Top: 113.67,18.14 121.92,18.14 121.92,10.52 113.67,10.52
  pour Top: 135.25,18.14 143.51,18.14 143.51,10.52 135.25,10.52
  pour Top: 37.97,53.77 46.23,53.77 46.23,45.52 37.97,45.52
  pour Top: 59.56,53.77 67.82,53.77 67.82,45.52 59.56,45.52
  pour Top: 76.71,53.77 84.71,53.77 84.71,45.52 76.71,45.52
  pour Top: 101.47,53.77 109.09,53.77 109.09,45.52 101.47,45.52
  pour Top: 119.25,53.77 127.25,53.77 127.25,45.52 119.25,45.52
  pour Top: 144.65,53.77 152.91,53.77 152.91,45.52 144.65,45.52
  pour Top: 26.67,86.56 34.29,86.56 34.29,78.94 26.67,78.94
  pour Top: 44.45,86.56 52.7,86.56 52.7,78.94 44.45,78.94
  pour Top: 66.67,86.56 74.3,86.56 74.3,78.94 66.67,78.94
  pour Top: 84.45,86.56 92.08,86.56 92.08,78.94 84.45,78.94
  pour Top: 106.05,86.56 114.3,86.56 114.3,78.94 106.05,78.94
  pour Top: 123.83,86.44 131.44,86.44 131.44,78.82 123.83,78.82
  pour Top: 26.16,118.92 34.16,118.92 34.16,111.3 26.16,111.3
  pour Top: 40.26,118.92 48.26,118.92 48.26,111.3 40.26,111.3
  pour Top: 62.36,118.92 69.98,118.92 69.98,111.3 62.36,111.3
  pour Top: 97.79,118.92 105.41,118.92 105.41,111.3 97.79,111.3
  pour Top: 111.51,118.92 119.13,118.92 119.13,111.3 111.51,111.3
  pour Top: 125.22,118.92 132.84,118.92 132.84,111.3 125.22,111.3
  pour Top: 36.96,85.29 42.29,85.29 42.29,79.96 36.96,79.96
  pour Top: 76.96,85.29 82.3,85.29 82.3,79.96 76.96,79.96
  pour Top: 116.59,85.29 121.54,85.29 121.54,79.96 116.59,79.96
  pour Top: 133.73,85.29 138.68,85.29 138.68,79.96 133.73,79.96
  pour Top: 35.69,117.02 39.12,117.02 39.12,113.21 35.69,113.21
  pour Top: 71.12,117.02 74.93,117.02 74.93,113.21 71.12,113.21
  pour Top: 106.55,117.02 110.36,117.02 110.36,113.21 106.55,113.21
  pour Top: 120.27,117.02 124.08,117.02 124.08,113.21 120.27,113.21
  pour Top: 140.21,51.61 140.21,54.66 144.27,54.66 144.27,51.61
  pour Top: 162.56,48.06 166.62,48.06 166.62,45.01 162.56,45.01
  pour Top: 84.84,48.06 89.15,48.06 89.15,45.01 84.84,45.01
  pour Top: 101.35,51.87 97.03,51.87 97.03,54.66 101.35,54.66
  pour Top: 128.02,47.8 132.84,47.8 132.84,44.25 128.02,44.25
  pour Top: 13.46,10.26 17.27,10.26 17.27,6.96 13.46,6.96
  pour Top: 38.86,6.71 43.69,6.71 43.69,3.15 38.86,3.15
  pour Top: 45.47,6.71 50.29,6.71 50.29,3.15 45.47,3.15
  pour Top: 120.65,6.71 125.48,6.71 125.48,3.15 120.65,3.15
  pour Top: 133.1,6.71 133.1,3.15 128.27,3.15 128.27,6.71
  pour Top: 153.67,12.55 158.5,12.55 158.5,8.99 153.67,8.99
  pour Top: 91.44,6.71 91.44,2.9 86.61,2.9 86.61,6.71
  pour Top: 41.4,18.14 49.28,18.14 49.28,20.93 41.4,20.93
  pour Top: 82.55,17.88 90.68,17.88 90.68,20.68 82.55,20.68
  pour Top: 124.21,17.88 131.83,17.88 131.83,20.68 124.21,20.68
  pour Top: 132.84,55.93 130.81,55.93 130.81,58.72 138.68,58.72 138.68,55.68
  pour Top: 44.96,55.68 44.96,58.47 52.32,58.47 52.32,55.68
  pour Top: 94.49,55.42 86.87,55.42 86.87,58.22 94.49,58.22
  pour Top: 59.69,51.87 54.86,51.87 54.86,55.17 59.69,55.17
  pour Top: 55.37,88.47 64.26,88.47 64.26,91.26 55.37,91.26
  pour Top: 14.99,89.23 23.62,89.23 23.62,92.15 14.99,92.15
  pour Top: 94.74,88.09 103.38,88.09 103.38,91.14 94.74,91.14
  pour Top: 15.49,121.21 24.51,121.21 24.51,124.38 15.49,124.38
  pour Top: 51.05,121.21 59.56,121.21 59.56,124.38 51.05,124.38
  pour Top: 86.61,121.21 95.38,121.21 95.38,124.38 86.61,124.38
  pour Top: 76.45,118.92 84.07,118.92 84.07,111.3 76.45,111.3
  pour Top (isolate 0.254): 19.05,115.37 19.05,116.38 21.34,116.38 21.34,114.86 20.07,114.86 20.07,113.84 17.78,113.84 17.78,115.37
  pour Top: 5,108.76 141.86,108.86 141.86,105.44 3.05,105.31 3,108.76
  pour Top: 175.77,110.29 175.77,113.33 180.85,113.33 180.85,110.29
  pour Top: 156.97,117.4 160.02,117.4 160.02,114.35 156.97,114.35
  pour Top (isolate 0.254, rank 2): 159.51,124.51 159.51,125.53 156.46,125.53 156.46,118.92 159.51,118.92
  pour Top: 169.67,128.07 167.13,128.07 167.13,127.05 169.67,127.05
  pour Top (isolate 0.254, rank 2): 165.1,135.18 165.1,137.21 168.15,137.21 168.15,132.64 165.61,132.64 165.61,135.18
  pour Top: 151.89,125.53 154.43,125.53 154.43,119.94 149.35,119.94 149.35,125.53
  pour Top (rank 2): 144.27,126.54 148.34,126.54 148.34,124.51 142.24,124.51 142.24,126.54
  pour Top (rank 2): 159.51,132.13 161.54,132.13 163.58,130.1 163.58,126.54 159.51,126.54
  pour Top (isolate 0.254, rank 2): 163.07,127.56 164.59,127.56 165,127.05 165,123.49 164.59,122.99 162.56,122.99 162.56,123.49 164.08,123.49 164.59,124 164.59,126.54 164.08,127.05 163.07,127.05
  pour Top: 157.45,118.19 156.79,118.19 156.79,118.82 156.84,118.87 157.4,118.87 157.45,118.82
  pour Top (isolate 0.254, rank 2): 159.56,116.89 165.76,116.89 165.76,115.54 165.56,114.83 160.58,114.83 160.02,114.27 159.54,114.27 159.54,116.87
  pour Top (isolate 0.254, rank 2): 176.28,118.92 178.31,118.92 178.82,118.59 178.82,117.91 178.33,117.55 176.3,117.55
  pour Top (isolate 0.254, rank 2): 175.77,125.02 175.77,125.53 177.8,125.53 178.31,125.53 178.82,125.02 178.31,124.51 175.77,124.51
  pour Top (isolate 0.254, rank 2): 170.18,111.81 173.74,111.81 174.24,111.3 174.24,110.79 169.67,110.79 169.67,111.3
  pour Top (isolate 0.254, rank 2): 163.45,117.93 162.05,117.91 160.53,119.43 159,119.43 159,119.94 161.04,119.94 162.31,118.67 163.47,118.67
  pour Top: 5.46,76.17 178.44,76.28 178.44,72.85 3.05,73 3.05,76.17
  pour Top: 84.33,6.71 84.33,2.9 79.5,2.9 79.5,6.71
  pour Top (isolate 0.254): 43.18,10.72 45.72,10.72 45.72,9.19 43.18,9.19
  pour Top: 52.07,47.8 52.07,46.02 49.28,46.02 49.28,48.06 52.07,48.06
  pour Top: 92.96,47.8 92.96,46.02 90.17,46.02 90.17,48.06 92.96,48.06
  pour Top: 136.65,47.8 136.65,46.02 134.11,46.02 134.11,48.06 136.65,48.06
  pour Top: 20.57,83.87 20.57,82.09 18.03,82.09 18.03,83.87
  pour Top: 60.71,82.85 60.71,81.08 57.91,81.08 57.91,82.85
  pour Top: 99.31,82.85 100.08,82.85 100.08,81.08 97.28,81.08 97.28,82.85
  pour Top: 55.88,116.13 56.64,116.13 56.64,114.1 53.59,114.1 53.59,116.13
  pour Top: 91.44,116.13 92.2,116.13 92.2,114.1 89.41,114.1 89.41,116.13
LDO_1_5V
  Top 0.254: TP_1.TP 46.46,63.53 46.99,64.06 48.26,64.06 48.64,63.68 | 48.64,63.68 48.77,63.55 48.77,63.04 49.78,62.03 51.67,62.03 C54.2 51.82,61.88 51.82,61.52 51.45,61.15 R2.1 | C56.OUT 49.48,64.51 48.64,63.68
  Top 0.356: C56.OUT 49.45,64.67 43.79,64.67 43.43,64.31 43.43,55.17 43.67,54.93 C2.1 C3.1 52.82,54.93 53.09,54.66 53.09,51.87 L1.2
LDO_2_5V
  Top 0.254: TP_2.TP 89.38,64.03 89.66,64.31 91.44,64.31 92.2,63.55 | 92.2,63.55 93.73,62.03 93.73,61.17 C59.2 93.73,61.04 93.73,60.13 R6.1 | 92.2,63.55 92.66,64 C61.OUT 92.63,64.82
  Top 0.356: 92.58,64.92 C61.OUT | L4.2 94.74,54.41 94.47,54.67 C7.1 C6.1 86.09,54.67 85.34,55.42 85.34,64.31 85.85,64.82 92.63,64.82
LDO_3_5V
  Top 0.254: TP_3.TP 135.05,63.47 135.38,63.8 138.68,63.8 | 138.68,63.8 138.94,63.8 139.95,62.79 139.95,61.93 C63.2 140.04,61.1 139.83,60.88 139.83,60.11 R9.1 | 138.76,65.48 138.76,63.88 138.68,63.8
  Top 0.356: C65.OUT 138.76,65.48 130.07,65.48 129.29,64.69 129.29,55.93 130.03,55.18 C10.1 C11.1 136.13,55.18 136.14,55.17 138.18,55.17 138.43,54.91 138.43,51.11 L7.1
LDO_4_5V
  Top 0.254: 24.89,96 C67.2 | C15.1 C16.1
  Top 0.356: TP_4.TP 20.57,98.35 20.83,98.6 23.11,98.6 23.37,98.35 | 23.37,98.35 24.89,96.82 24.89,96 | 23.37,98.35 23.59,98.57 C69.OUT 23.52,99.57 13.77,99.57 12.95,98.75 12.95,88.95 13.3,88.61 C15.1 | 22.1,87.2 22.1,88.52 22.05,88.57 19.09,88.57 C16.1 | C67.2 25.05,95.21 24.64,94.79 24.64,93.38 R12.1
  Top 0.406: 22.1,87.2 L10.2
LDO_5_5V
  Top 0.254: R16.1 65.02,92.62 65.02,94.79 65.19,94.95 C71.2 65.28,95.93 65.28,96.82 64.39,97.71 | TP_5.TP 61.98,97.59 62.48,98.09 64.01,98.09 64.39,97.71 | C75.OUT 64.74,98.06 64.39,97.71
  Top 0.356: C75.OUT 55.65,98.88 54.61,97.84 54.61,87.93 54.86,87.68 57.49,87.68 C19.1 C20.1 62.19,87.72 62.48,87.43 L11.2
  Top 0.406: 62.37,86.04 L11.2
LDO_6_5V
  Top 0.254: TP_6.TP 100.84,97.33 101.09,97.59 102.11,97.59 102.36,97.33 | 102.36,97.33 102.36,97.08 103.38,96.06 104.14,96.06 104.14,95.23 C77.2 R22.1 | C79.OUT 102.84,97.81 102.36,97.33
  Top 0.356: L12.1 101.85,87.17 101.6,87.43 98.84,87.43 C24.1 C23.1 96.86,87.43 93.73,87.43 93.22,87.93 93.22,97.33 94.26,98.37 C79.OUT
LDO_7_5V
  Top 0.254: R25.1 25.57,126.45 26.42,127.3 26.42,128.23 C81.2 26.32,128.92 25.62,129.62 | 25.62,129.62 24.64,130.61 23.62,130.61 23.37,130.35 23.37,129.08 TP_7.TP | C83.OUT 25.62,129.62
  Top 0.356: C83.OUT 15.24,131.37 13.21,129.34 13.21,121.72 14.34,120.59 C27.1 C28.1 22.46,120.59 22.86,120.19 22.86,119.18 L13.2
LDO_8_5V
  Top 0.254: C87.OUT | 57.78,129.67 57.78,130.91 57.84,130.96 58.98,130.96 59.99,129.95 | 59.99,129.95 60.64,129.3 C85.2 | 59.99,131.54 59.99,129.95 | 60.66,128.53 60.66,127.51 60.39,127.24 R28.1
  Top 0.356: L14.2 arc90 58.34,119.1 58.34,120.45 arc90 58.2,120.59 C32.1 C31.1 arc90 C31.1 49.51,120.6 arc-90 48.13,121.97 48.13,130.35 arc-90 49.38,131.6 C87.OUT 59.99,131.54 | TP_8.TP 57.78,129.67 | C85.2 60.66,128.53
LDO_9_5V
  Top 0.254: R31.1 96.01,125.69 96.01,127.05 96.5,127.54 C89.2 96.52,128.36 | 88.63,120.45 C35.1 | 93.58,120.59 93.73,120.45 93.73,119.18 L15.2 | TP_9.TP 93.09,130.73 93.22,130.86 | 95.12,130.48 95.25,130.35
  Top 0.356: 88.63,120.45 85.09,120.45 84.33,121.21 84.33,130.35 85.72,131.75 C91.OUT 95.32,130.68 95.12,130.48 94.74,130.86 93.22,130.86 | C35.1 C36.1 93.58,120.59 | 95.25,130.35 95.25,130.1 96.01,129.34 96.52,129.34 96.52,128.36
LDO_10_5V
  Top 0.254: R34.1 50.29,22.87 50.29,24.69 50.71,25.1 C93.2 50.8,25.8 50.8,26.47 50.29,26.97 48.77,26.97 48.39,27.36 | TP_10.TP 46.25,27.76 46.74,28.24 47.5,28.24 48.39,27.36 | C95.OUT 49.5,28.47 48.39,27.36
  Top 0.356: C95.OUT 40.31,29.44 40.13,29.26 40.13,17.83 40.64,17.32 43.24,17.32 C40.1 C41.1 47.94,17.39 48.26,17.07 48.26,15.22 L18.2
LDO_11_5V
  Top 0.254: TP_11.TP 88.11,26.7 88.9,27.48 89.41,27.48 90.3,26.59 | 90.3,26.59 91.19,25.7 91.69,25.7 91.69,24.96 C97.2 91.65,23.63 91.44,23.42 91.44,22.82 R37.1 | C99.OUT 90.98,27.27 90.3,26.59
  Top 0.356: L21.2 90.04,16.94 89.92,17.07 86.42,17.07 C45.1 C44.1 81.98,17.13 80.77,18.34 80.77,27.36 81.48,28.07 90.88,28.07 C99.OUT
LDO_12_5V
  Top 0.254: 132.85,24.94 132.85,23.94 132.59,23.67 132.59,22.44 R40.1 | TP_12.TP 127.31,27.03 127.76,27.48 129.79,27.48 130.68,26.59 | 130.68,26.59 131.32,25.96 132.84,25.96 132.84,25.21 C101.2 | C103.OUT 131.19,27.1 130.68,26.59
  Top 0.356: L24.2 131.19,16.69 130.81,17.07 127.7,17.07 C49.1 C48.1 123.12,17.13 122.43,17.83 122.43,27.97 123.17,28.73 123.7,28.75 131.14,28.73 C103.OUT | 132.85,24.94 C101.2
LNA_1_IN
  Top 0.254: C1.2 49.77,47.81 LNA_1.3
LNA_1_OUT
  Top 0.254: LNA_1.1 52.69,46.39 53.34,47.04 L1.1 53.84,48.82 55.12,48.82 55.39,48.55 C4.1
LNA_2_IN
  Top 0.254: 90.68,47.82 LNA_2.3 90.42,47.85 90.42,48.31 90.79,48.68 C5.2
LNA_2_OUT
  Top 0.254: LNA_2.1 94.35,46.39 94.74,46.79 L4.1 97.16,48.18 97.28,48.06 97.28,46.04 C8.2
LNA_3_IN
  Top 0.254: C9.2 134.99,48.93 134.37,48.31 134.37,47.73 LNA_3.3
LNA_3_OUT
  Top 0.254: LNA_3.1 137.78,46.39 138.43,47.04 138.43,48.05 L7.2 140.34,48.18 140.46,48.06 140.46,46.93 C12.1
LNA_4_IN
  Top 0.254: C14.2 16.37,83.75 16.51,83.9 17.27,83.9 17.53,83.64 18.27,83.64 LNA_4.3
LNA_4_OUT
  Top 0.254: LNA_4.1 21.32,82.36 21.84,82.88 21.84,83.89 L10.1 22.61,83.89 22.61,83.13 22.87,82.87 C17.1
LNA_5_IN
  Top 0.254: C18.2 56.37,82.87 56.64,83.13 57.15,83.13 57.66,82.63 58.27,82.63 LNA_5.3
LNA_5_OUT
  Top 0.254: LNA_5.1 61.45,81.34 61.98,81.86 61.98,82.62 L11.1 62.88,82.74 C21.1
LNA_6_IN
  Top 0.254: C22.2 97.41,81.99 97.54,82.12 97.54,82.52 LNA_6.3
LNA_6_OUT
  Top 0.254: LNA_6.1 100.82,81.34 101.35,81.86 101.35,82.62 L12.2 102.25,82.74 C25.1
LNA_7_IN
  Top 0.254: C26.2 16.62,115.99 16.76,116.13 17.27,116.13 17.65,115.75 18.52,115.75 LNA_7.3
LNA_7_OUT
  Top 0.254: LNA_7.1 22.21,114.46 22.61,114.86 22.61,116.13 L13.1 23.13,115.86 C29.1
LNA_8_IN
  Top 0.254: C30.2 51.55,115.86 51.82,116.13 52.7,116.13 53.09,115.75 54.08,115.75 LNA_8.3
LNA_8_OUT
  Top 0.254: LNA_8.1 57.52,114.46 57.91,114.86 57.91,115.87 L14.1 58.94,115.6 C33.1
LNA_9_IN
  Top 0.254: C34.2 87.74,115.99 87.88,116.13 88.52,116.13 88.9,115.75 89.64,115.75 LNA_9.3
LNA_9_OUT
  Top 0.254: LNA_9.1 93.08,114.46 93.47,114.86 93.47,115.87 L15.1 94.25,115.86 C37.1
LNA_10_IN
  Top 0.254: C39.2 L17.1 41.53,8.48 42.42,8.48 42.67,8.74 42.67,10.01 43.22,10.55 LNA_10.3
LNA_10_OUT
  Top 0.254: LNA_10.1 46.24,9.23 46.74,8.74 47.37,8.74 | 47.37,8.74 L19.1 49.28,8.23 50.04,8.99 50.91,8.99 C42.1 | 48.13,12.04 48.13,11.02 47.62,10.52 47.62,8.99 47.37,8.74
  Top 0.406: L18.1 48.13,12.04
LNA_11_IN
  Top 0.254: C43.2 L20.1 83.06,8.23 83.31,8.48 83.31,10.26 83.6,10.55 LNA_11.3
LNA_11_OUT
  Top 0.254: LNA_11.1 86.47,8.38 86.61,8.23 L22.1 | L21.1 90.04,10.77 89.03,9.75 L22.1 | L22.1 91.95,8.23 92.2,8.48 92.2,9.13 C46.1
LNA_12_IN
  Top 0.254: C47.2 124.08,10.64 122.94,9.5 122.94,8.36 L23.1 124.71,8.23 124.97,8.48 124.97,10.01 125.51,10.55 LNA_12.3
LNA_12_OUT  (1 unrouted)
  Top 0.254: LNA_12.1 128.12,8.63 128.52,8.23 L25.1 | L24.1 131.06,11.4 131.06,10.01 130.68,9.63 L25.1 133.35,8.23 133.6,8.48 133.6,9.13 C50.1
N$12  (1 unrouted)
  Top 0.254: LDO_1.3 53.09,64.06 52.95,63.92 C54.1 52.95,60.13 | R2.2 53.09,60.52 53.09,57.21 R3.1
N$13
  Top 0.254: C53.1 58.99,63.99 58.93,64.06 LDO_1.6
N$14
  Top 0.356: LDO_1.7 58.93,64.71 | 58.93,64.71 59.77,64.71 C55.OUT | LDO_1.8 58.28,65.36 58.93,64.71
N$15
  Top 0.356: LDO_1.2 52.98,64.71 | 52.98,64.71 52.83,64.57 52.15,64.57 C56.IN | LDO_1.1 53.63,65.36 52.98,64.71
N$16
  Top 0.254: LDO_2.3 96.22,63.76 95.25,62.79 95.25,62.28 95,62.03 95,61.1 C59.1 R6.2 R7.1
N$17
  Top 0.254: C58.1 101.16,63.74 101.09,63.8 99.87,63.8 LDO_2.6
N$18
  Top 0.356: LDO_2.7 101.35,64.41 | 101.35,64.41 C60.OUT | LDO_2.8 100.7,65.06 101.35,64.41
N$19
  Top 0.356: LDO_2.2 96.11,64.41 | 96.11,64.41 95.76,64.06 95.25,64.06 C61.IN | LDO_2.1 96.25,65.06 96.01,64.82 96.01,64.51 96.11,64.41
N$20
  Top 0.254: LDO_3.3 141.99,63.81 141.99,63.8 141.73,63.8 141.22,63.3 141.22,61.86 C63.1 141.24,61.25 141.48,61.01 141.48,60.08 R9.2 141.49,57.47 141.22,57.2 139.53,57.2 R10.1
N$22
  Top 0.254: C62.1 148.1,63.53 147.83,63.8 LDO_3.6
N$24
  Top 0.356: LDO_3.7 148.34,64.46 | 148.34,64.46 149.27,64.46 C64.OUT | LDO_3.8 147.69,65.11 148.34,64.46
N$25
  Top 0.356: LDO_3.2 141.99,64.46 | 141.99,64.46 141.59,64.46 141.48,64.57 C65.IN | LDO_3.1 142.64,65.11 141.99,64.46
N$27
  Top 0.254: LDO_4.3 27.13,99.06 26.42,98.35 26.42,96 C67.1 R12.2 26.25,90.82 26.16,90.73 24.45,90.73 R14.1
N$28
  Top 0.356: C66.1 32.86,99.02 32.77,99.11 31.31,99.11 LDO_4.6
N$30
  Top 0.254: 33.28,100.36 C68.OUT
  Top 0.356: LDO_4.7 32.26,99.71 | 32.26,99.71 33.12,99.71 33.27,99.87 33.27,100.36 C68.OUT | LDO_4.8 32.02,100.36 32.26,100.13 32.26,99.71
N$33
  Top 0.356: C69.IN 26.7,99.64 | 26.7,99.64 28.1,99.64 LDO_4.2 | LDO_4.1 27.59,100.36 27.53,100.3 27.36,100.3 26.7,99.64
N$34
  Top 0.254: LDO_5.3 68.51,98.09 67.56,98.09 67.56,96.32 67.08,95.83 C71.1 66.39,94.45 66.55,94.28 66.55,92.62 R16.2 66.55,92.44 66.55,89.71 66.52,89.74 R19.1
N$36
  Top 0.356: C70.1 73.24,97.49 72.64,98.09 71.7,98.09 LDO_5.6
N$38
  Top 0.356: LDO_5.7 73.41,98.7 | 73.41,98.7 74.01,98.7 74.17,98.86 74.17,99.24 C74.OUT | LDO_5.8 72.63,99.35 72.64,99.36 72.74,99.36 73.41,98.7
N$39
  Top 0.254: 68.23,98.7 68.07,98.86 | 67.36,98.86 C75.IN | 68.09,99.35 68.07,99.36
  Top 0.356: LDO_5.2 68.23,98.7 | 67.36,98.86 68.07,98.86 68.07,99.36 | LDO_5.1 68.09,99.35
N$40
  Top 0.254: LDO_7.3 28.89,130.54 28.45,130.1 28.45,128.57 28.19,128.32 C81.1 27.52,125.53 R25.2 27.27,123.33 26.42,122.48 R26.1
N$41
  Top 0.254: R23.1 106.15,89.74 106.17,89.71 106.17,90.73 105.92,90.98 105.92,92.44 R22.2 105.92,92.62 105.92,94.03 105.5,94.45 C77.1 105.41,95.16 105.41,97.08 105.62,97.29 LDO_6.3
N$42
  Top 0.254: C76.1 111.85,97.24 111.76,97.33 110.56,97.33 LDO_6.6
N$43
  Top 0.356: LDO_6.7 112.52,97.94 | 112.52,97.94 113.13,97.94 113.28,98.09 113.28,98.43 C78.OUT | LDO_6.8 111.74,98.59 111.76,98.6 111.86,98.6 112.52,97.94
N$45
  Top 0.356: LDO_6.2 106.58,97.94 106.3,98.22 | 106.3,98.22 106.17,98.35 105.47,98.35 C79.IN | LDO_6.1 106.66,98.59 106.3,98.22
N$46
  Top 0.356: LDO_7.6 33.6,130.54 33.78,130.35 33.78,129.34 33.02,128.57 33.02,127.97 C80.1
N$47
  Top 0.356: LDO_7.7 33.53,131.19 | 33.53,131.19 34.2,131.19 C82.OUT | LDO_7.8 33.31,131.84 33.53,131.62 33.53,131.19
N$48
  Top 0.356: LDO_7.2 29.39,131.19 29.21,131.37 28.96,131.37 | 28.96,131.37 C83.IN | LDO_7.1 29.42,131.84 28.96,131.37
N$49
  Top 0.254: R28.2 62.03,125.82 62.03,127.13 61.84,127.31 C85.1 61.84,129.34 61.87,129.34 61.87,129.39 62.79,129.39 62.79,130.51 LDO_8.3 | 62.08,125.74 62.08,123.67 61.37,122.96 R29.1
  Top 0.356: R28.2 62.08,125.74
N$50
  Top 0.254: 67.16,130.45 LDO_8.6
  Top 0.356: C84.1 67.43,128.79 68.45,129.82 68.45,130.3 68.3,130.45 67.16,130.45
N$51
  Top 0.254: 68.68,131.16 C86.OUT | LDO_8.8 67.17,131.88
  Top 0.356: LDO_8.7 67.82,131.16 | 67.82,131.16 68.68,131.16 | 67.17,131.88 67.56,131.88 67.82,131.62 67.82,131.16
N$52
  Top 0.254: 63.04,131.6 63.27,131.6 | 63.97,131.77 LDO_8.1
  Top 0.356: C87.IN 63.04,131.6 63.48,131.16 LDO_8.2 | 63.27,131.6 63.45,131.77 63.97,131.77
N$53
  Top 0.254: LDO_9.3 98.41,130.46 98.3,130.35 98.3,129.84 97.79,129.34 97.79,128.43 C89.1 97.7,125.7 R31.2 97.78,123.25 97.79,123.24 97.79,122.99 97.54,122.73 96.18,122.73 R32.1
N$54
  Top 0.254: 103.58,130.46 103.66,130.38 | 103.23,127.85 C88.1
  Top 0.356: LDO_9.6 103.58,130.46 | 103.66,130.38 103.66,129.01 103.23,128.57 103.23,127.85
N$56
  Top 0.254: LDO_9.8 | LDO_9.7 102.65,131.17
  Top 0.356: 102.65,131.17 103.38,131.17 | 103.38,131.17 C90.OUT | LDO_9.8 103.25,131.75 103.38,131.62 103.38,131.17
N$57
  Top 0.254: LDO_9.1 | 98.81,131.11
  Top 0.356: C91.IN 98.81,131.75 | 98.81,131.75 LDO_9.1 | LDO_9.2 98.81,131.11 | 98.81,131.11 98.81,131.75
N$61
  Top 0.254: LDO_10.3 53.4,28.81 52.83,28.24 52.07,28.24 52.07,25.87 C93.1 51.91,22.93 R34.2 52.07,22.77 52.07,19.86 51.94,19.74 R35.1
N$62
  Top 0.254: C92.1 58.8,26.09 58.93,26.21 58.93,28.75 57.18,28.75 LDO_10.6
N$63
  Top 0.254: LDO_10.7 58.93,29.46 | 58.93,29.46 59.33,29.46 59.44,29.57 C94.OUT | LDO_10.8 58.23,30.11 58.24,30.1 58.29,30.1 58.93,29.46
N$64
  Top 0.254: 52.12,29.46 C95.IN | 53.41,30.11 53.39,30.12 53.39,30.09
  Top 0.356: LDO_10.2 52.76,29.46 | 52.76,29.46 52.12,29.46 | LDO_10.1 53.41,30.11 | 53.39,30.09 52.76,29.46
N$66
  Top 0.254: LDO_11.3 94.39,27.13 92.96,25.7 92.96,25.03 C97.1 92.85,22.63 R37.2 92.96,22.52 92.96,19.61 92.81,19.46 R38.1
N$67
  Top 0.254: C96.1 98.39,25.03 99.31,25.96 99.31,27.15 98.06,27.15 LDO_11.6
N$68
  Top 0.356: LDO_11.7 99.82,27.78 | 99.82,27.78 C98.OUT | LDO_11.8 99.17,28.43 99.82,27.78
N$69
  Top 0.356: LDO_11.2 94.54,27.78 94.18,28.14 | 94.18,28.14 93.6,28.14 C99.IN | LDO_11.1 94.47,28.43 94.18,28.14
N$70
  Top 0.254: LDO_12.3 136.16,27.99 134.62,27.99 134.18,27.55 C101.1 134.18,23.86 134.37,23.67 134.37,22.36 R40.2 134.38,19.37 134.11,19.1 132.42,19.1 R41.1
N$71
  Top 0.254: C100.1 139.82,26.08 140.72,26.97 140.72,27.99 139.32,27.99 LDO_12.6
N$72
  Top 0.356: LDO_12.7 140.97,28.67 | 140.97,28.67 141.94,28.67 C102.OUT | LDO_12.8 140.32,29.32 140.97,28.67
N$73
  Top 0.356: LDO_12.2 134.62,28.67 | 134.62,28.67 C103.IN | LDO_12.1 135.27,29.32 134.62,28.67
N$169
  Top 0.254: L31.2 143.18,123.88 143.97,123.09 145.22,123.09 C500.1
N$178
  Top 0.254: IC58.30 161.04,117.5 Q2.1
N$180
  Top 0.254: IC58.8 R4.1 | R4.1 | R4.1 176.2,120.02 TP10.TP
N$191
  Top 0.254: IC58.22 160.36,123.9 R206.2
N$193
  Top 0.254: IC58.26 160.36,120.7 R205.2
N$196
  pour Top: 165.99,117.91 169.67,117.91 169.67,112.32 165.99,112.32
N$199  (8 unrouted)
  Top 0.254: IC58.10 170.18,123.9 170.18,124 169.2,124 IC58.42N
  pour Top (no thermals): 169.42,125.53 170.56,125.53 170.56,123.62 169.42,122.48 166.37,122.48 165.23,123.62 165.23,125.53
N$213
  Top 0.356: R201.1 178.31,109.27 LED1.A
PRE_PWR_10  (21 unrouted)
PRE_PWR_12  (1 unrouted)
SAW+6_OUT
  Top 0.254: SAW_6.6 83.57,82.63 83.82,82.88 X13.1 92.46,82.88 93.22,82.12 94.5,82.12 C22.1
SAW_1_OUT  (1 unrouted)
  Top 0.254: 36.01,54.72 37.08,53.64 37.08,50.09 37.59,49.58 X2.1 47.89,49.58 C1.1
SAW_2_IN
  Top 0.254: C4.2 57.14,50.07 L2.2 58.55,50.21 59.18,49.58 X3.1 70.4,49.58 SAW_2.2
SAW_2_OUT
  Top 0.254: SAW_2.6 80.64,49.45 X4.1 80.9,49.71 L3.2 88.91,49.71 C5.1
SAW_3_IN
  Top 0.254: C8.1 99.05,49.94 L5.2 100.46,50.09 100.97,49.58 X5.1 112.18,49.58 SAW_3.2
SAW_3_OUT
  Top 0.254: SAW_3.6 123.06,49.45 X6.1 130.18,49.58 L6.2 133.11,49.46 C9.1
SAW_4_IN
  Top 0.254: C12.2 142.35,49.85 L8.2 148.47,49.96 X7.1 156,49.58 SAW_4.2
  Top 0.406: 155.87,49.2 SAW_4.2
SAW_4_OUT
  Top 0.254: SAW_4.6 164.34,49.45 L9.2 165.74,49.71 165.86,49.83 166.64,49.83 C13.1
  Top 0.406: 164.09,49.96 L9.2 164.59,49.96
SAW_5_IN
  Top 0.254: C17.2 24.62,82.61 24.89,82.88 X10.1 35.31,82.88 35.56,82.63 SAW_5.2
SAW_5_OUT
  Top 0.254: SAW_5.6 43.43,82.63 43.69,82.88 X11.1 52.58,82.88 53.59,81.86 54.5,81.86 C18.1
SAW_6_IN
  Top 0.254: C21.2 64.63,82.48 65.02,82.88 X12.1 75.44,82.88 75.69,82.63 SAW_6.2
SAW_7_8_RF
  Top 0.254: SAW_7.6 X15.1 SAW_8.2
SAW_7_IN
  Top 0.254: C25.2 104,82.23 104.65,82.88 X14.1 115.06,82.88 115.32,82.63 SAW_7.2
SAW_9_IN
  Top 0.254: C29.2 24.88,114.84 25.15,115.11 X18.1 SAW_9.2
SAW_9_OUT
  Top 0.254: SAW_9.5 X19.1 C30.1
SAW_10_IN
  Top 0.254: C33.2 60.69,114.84 60.96,115.11 X20.1 SAW_10.2
SAW_10_OUT
  Top 0.254: SAW_10.5 X21.1 C34.1
SAW_11_12_RF
  Top 0.254: SAW_11.5 X23.1 SAW_12.2
SAW_11_IN
  Top 0.254: C37.2 96,114.84 96.27,115.11 X22.1 SAW_11.2
SAW_13_IN
  Top 0.254: C38.2 22.01,10.78
  Top 0.406: 22.01,10.78 SAW_13.10
SAW_13_OUT
  Top 0.254: SAW_13.5 29.07,18.27 29.72,17.63 29.72,14.83 29.97,14.58 34.42,14.58 X26.1 39.24,14.45 39.88,13.82 41.26,13.82 C39.1
SAW_14_IN
  Top 0.254: C42.2 51.18,13.13 52.32,14.27 57.1,14.27 X27.1 61.42,14.33 61.85,13.89 61.85,10.85 61.98,10.72 63.99,10.72 SAW_14.10
SAW_14_OUT
  Top 0.254: SAW_14.5 71.49,18.27 71.63,18.14 71.63,14.58 71.88,14.33 76.07,14.33 X28.1 80.39,14.45 81.03,13.82 81.9,13.82 C43.1
SAW_15_IN
  Top 0.254: C46.2 92.33,14.15 92.46,14.27 97.74,14.27 X29.1 102.06,14.33 102.62,13.77 102.62,11.23 103.12,10.72 105.64,10.72 SAW_15.10
SAW_15_OUT
  Top 0.254: SAW_15.5 112.84,18.27 113.28,17.83 113.28,15.16 114.05,14.4 117.81,14.4 X30.1 122.12,14.45 122.81,13.77 124.04,13.77 C47.1
SAW_16_IN
  Top 0.254: C50.2 133.73,14.2 133.86,14.33 X31.1 143.76,14.33 144.02,14.07 144.02,11.02 144.27,10.77 145.98,10.77 SAW_16.10
  Top 0.61: 145.97,10.78 SAW_16.10
SAW_16_OUT
  Top 0.254: SAW_16.5 154.53,18.27 C51.1

## Text on the board
tPlace: 70cm | 1.25m | 2m | 4m
LayoutNotes: You must do a "poly 'gnd" each polygon to associate it with ground. | You must do a "via 'gnd" command to make the via a ground otherwise you will see circles in the polygon